# EAGLE board A10S-OLinuXino-MICRO_Rev_D (EAGLE 9.6.2), part 1 of 4
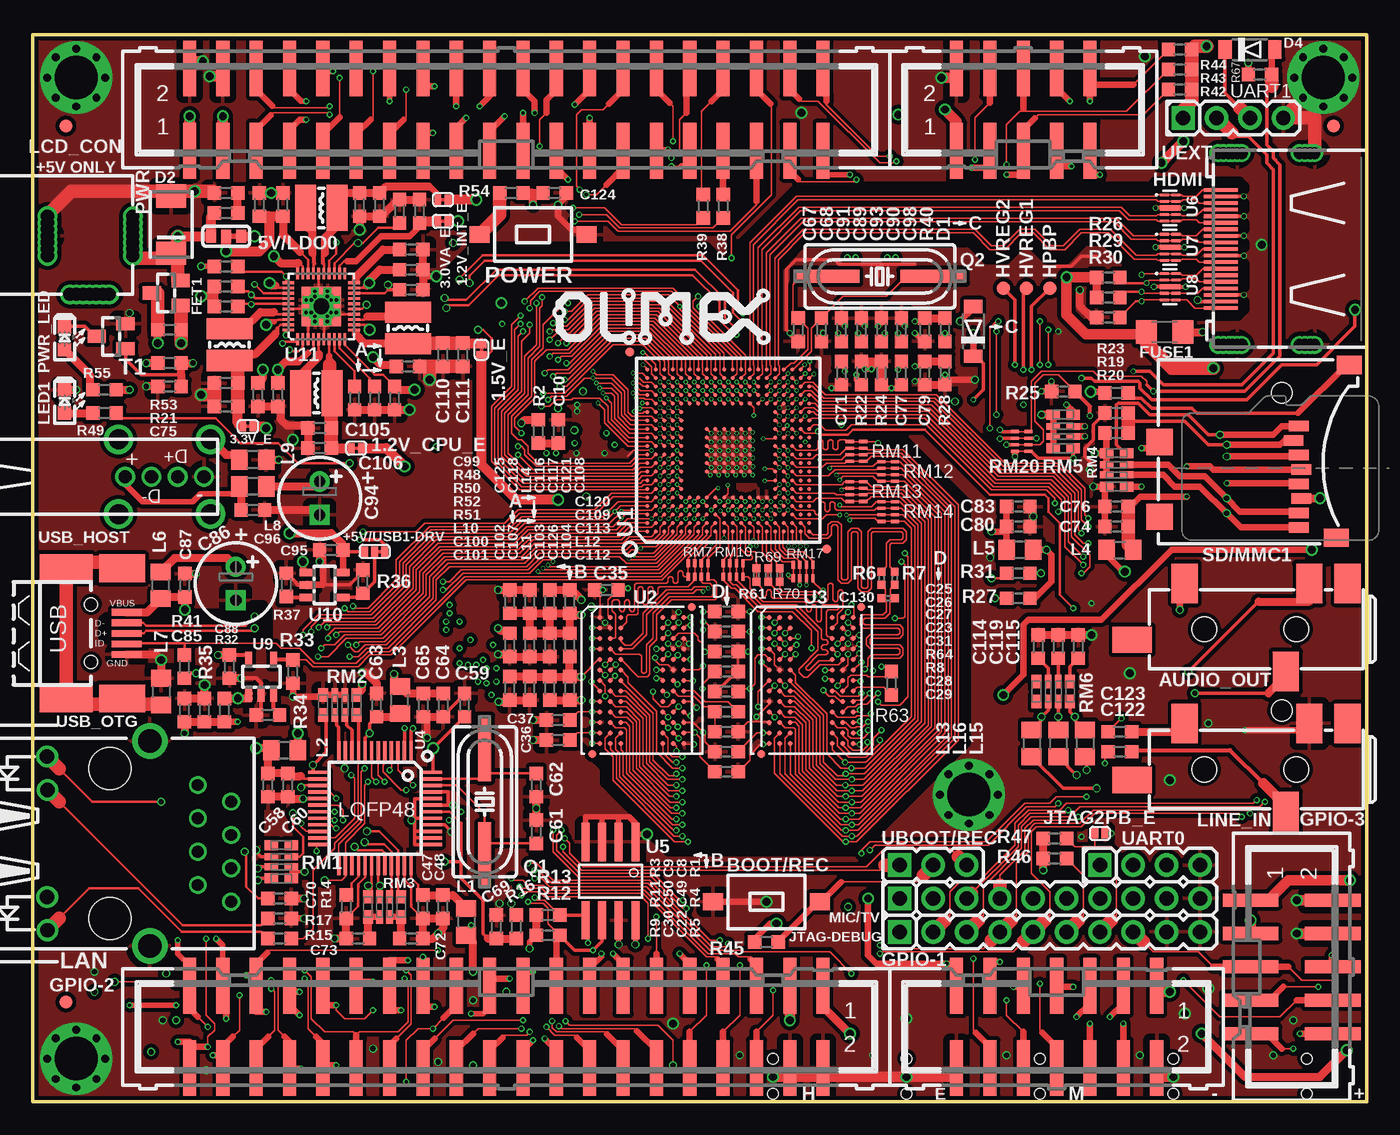
[diagram p5: board, top side]
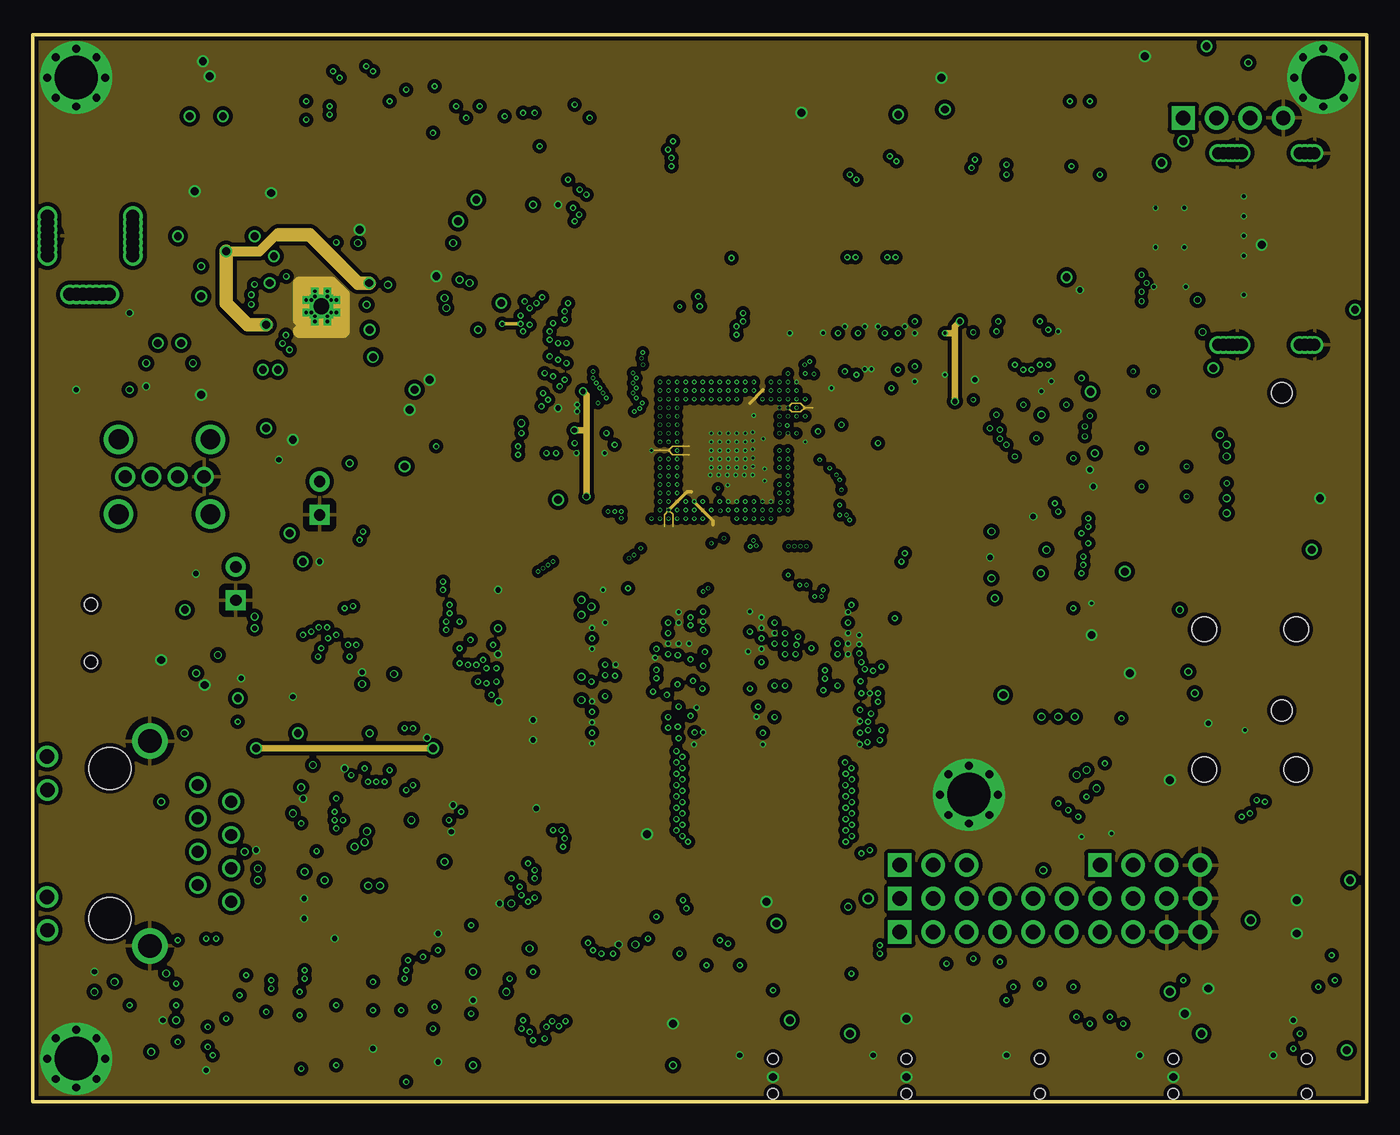
[diagram p6: board, inner layer Route2]
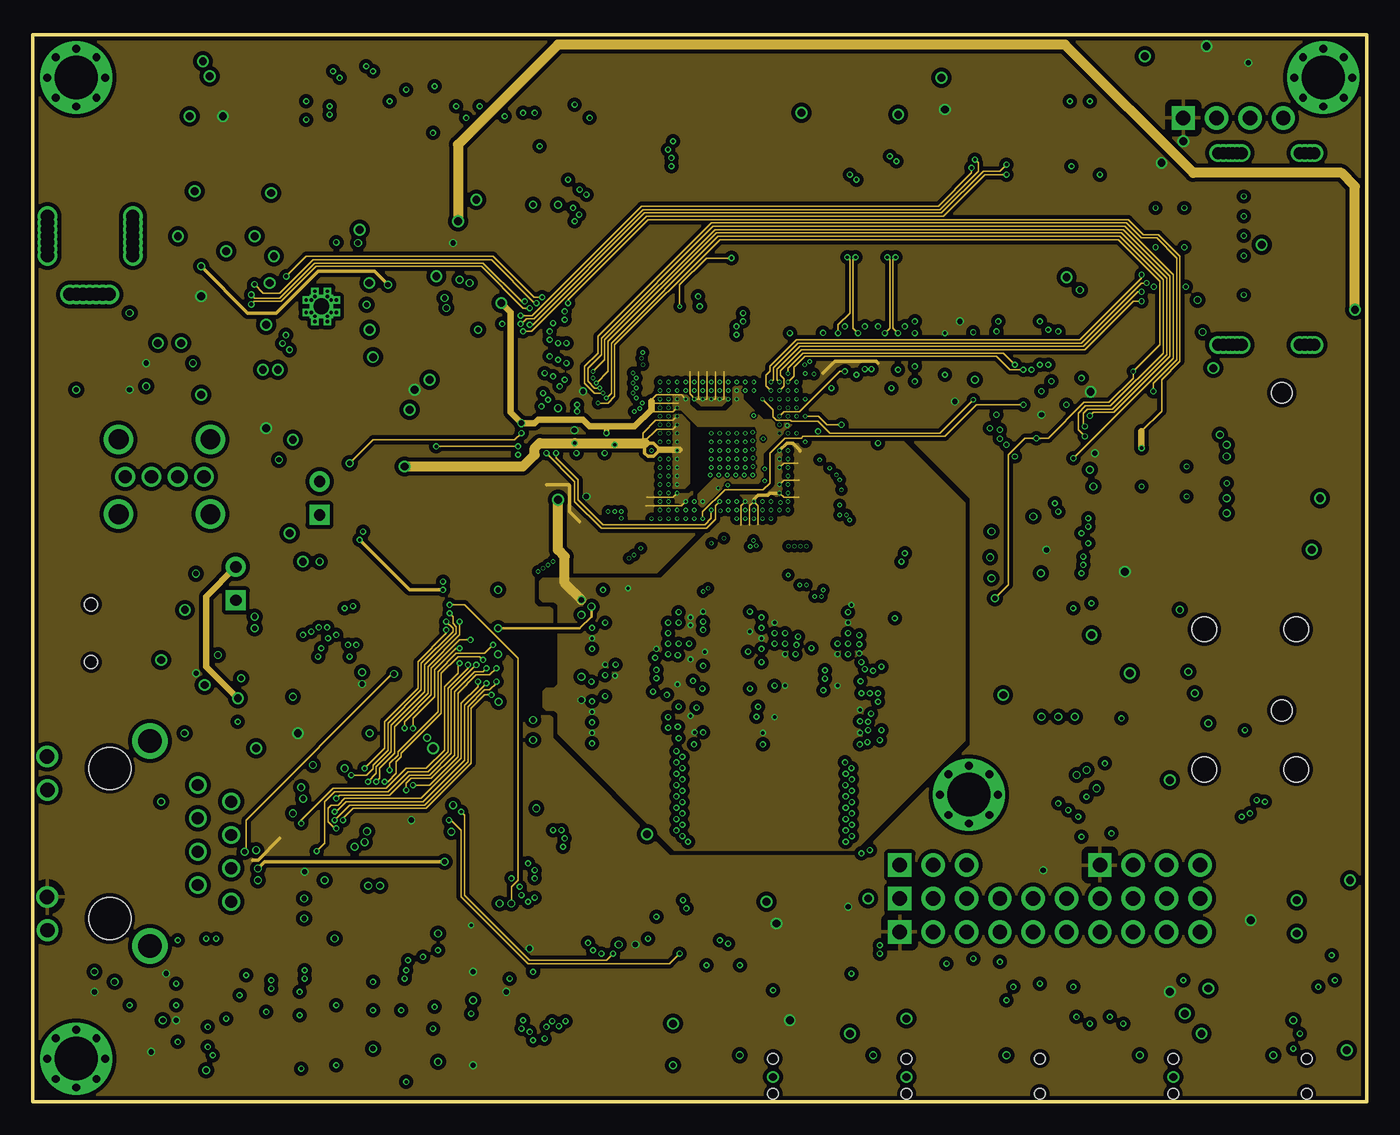
[diagram p7: board, inner layer Route15]
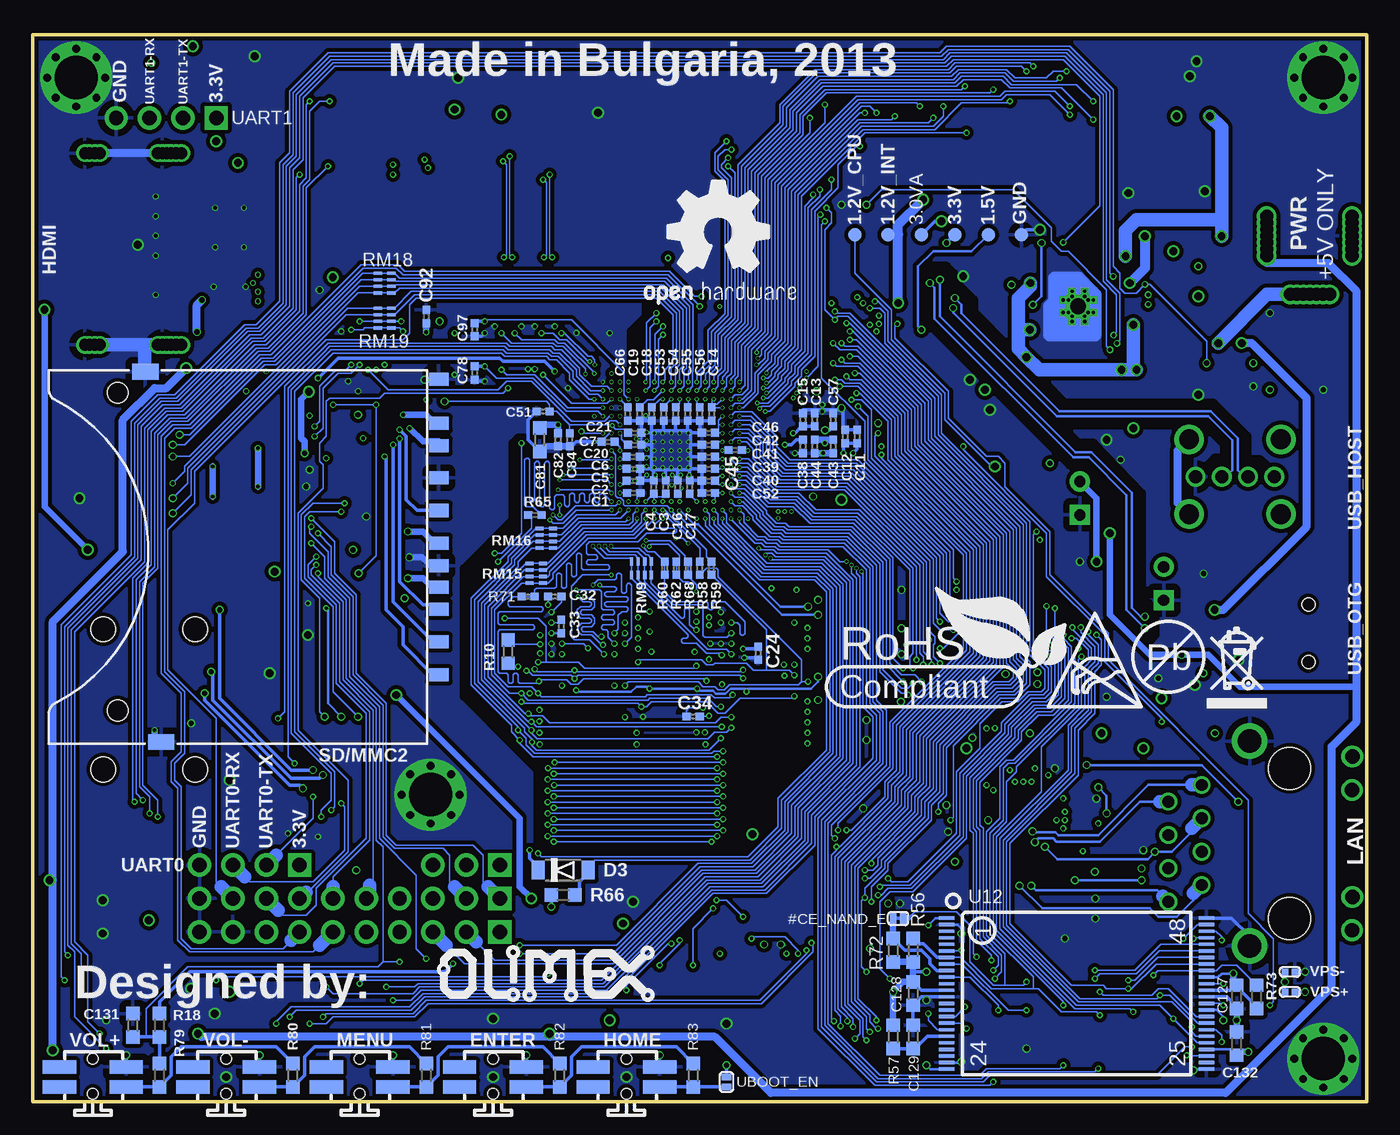
[diagram p8: board, bottom side, seen from below]

Size 101.6 x 81.28 mm. Coordinates in mm from the lower left corner, seen from the top.
Outline: 0,0 101.6,0 101.6,81.28 0,81.28 0,0
Copper layers (1*2*15*16): Top 0.018mm / dielectric 0.12mm / Route2 0.035mm / dielectric 1.2mm / Route15 0.035mm / dielectric 0.12mm / Bottom 0.018mm
Design rules "default": minimum track width 4mil, minimum drill 0.2mm, track to track 5mil, track to pad 5mil, pad to pad 5mil, via to via 5mil, smd to smd 1mil, copper to edge 10mil, drill to drill 8mil, minimum pad ring 6mil, minimum via ring 2.5mil, stop-mask expansion 4mil, vias tented up to drill 25mil, thermal gap 20mil
tRestrict: 172 lines
bRestrict: 174 lines

## Footprints (pad centres in the part's own frame; a part is rotated, then mirrored left to right if it is on the bottom)
TESTPAD_40-ROUND = smd 1.016 x 1.016: 1 0,0
SJ_1_SMALLER_CLOSE = smd 0.508 x 0.762: 1 -0.381,0; 2 0.381,0
SJ_2_SMALL_12_TIED = smd 0.762 x 1.016: 1 -1.143,0; 2 0,0; 3 1.143,0
SJ_2_SMALLER = smd 0.508 x 0.762: 1 -0.762,0; 2 0,0; 3 0.762,0
PJ-W47S-05D2-LF_5PIN_V2 = smd 2 x 3: 1 2.1,-0.5; 2 14.5,-0.5; 3 6.8,6.2; 5 5,-0.5 | smd 3 x 2: 4 18.5,3.8 | hole 1.9: 6,3; 13,3
SW-TAKT_6X3.5_SMD = smd 1.27 x 1.524: P$1 0,4.064; P$2 0,-4.064
C0402_TI = smd 0.61 x 0.584: 1 -0.508,0; 2 0.508,0
C0603_DWS = smd 1.016 x 1.016: 1 -0.889,0; 2 0.889,0
E2,5-6,3 = drill 0.864 pad 1.524: + -1.27,0 | drill 0.864 pad 1.524 square: - 1.27,0
SOD-123 = smd 1 x 1.4: A 1.9,0; C -1.9,0
DO214AA = smd 1.778 x 2.286: A 2.177,0; C -2.177,0
SW_TAKT3X4 = smd 2.54 x 1.016: 1_1 -2.54,0.762; 1_2 2.54,0.762; 2_1 -2.54,-0.762; 2_2 2.54,-0.762 | hole 0.8: 0,-1.397; 0,1.27
SOT23 = smd 1 x 1.4: 1 -0.95,-1.1; 2 0.95,-1.1; 3 0,1.1
1206 = smd 1.6 x 1.8: 1 -1.4,0; 2 1.4,0
ML14_S = smd 1 x 4.25: 1 -7.62,-3.125; 2 -7.62,3.125; 3 -5.08,-3.125; 4 -5.08,3.125; 5 -2.54,-3.125; 6 -2.54,3.125; 7 0,-3.125; 8 0,3.125; 9 2.54,-3.125; 10 2.54,3.125; 11 5.08,-3.125; 12 5.08,3.125; 13 7.62,-3.125; 14 7.62,3.125
ML40-MALE(GBH-254-SMT-40) = smd 1 x 4.25: 1 -24.13,-3.125; 2 -24.13,3.125; 3 -21.59,-3.125; 4 -21.59,3.125; 5 -19.05,-3.125; 6 -19.05,3.125; 7 -16.51,-3.125; 8 -16.51,3.125; 9 -13.97,-3.125; 10 -13.97,3.125; 11 -11.43,-3.125; 12 -11.43,3.125; 13 -8.89,-3.125; 14 -8.89,3.125; 15 -6.35,-3.125; 16 -6.35,3.125; 17 -3.81,-3.125; 18 -3.81,3.125; 19 -1.27,-3.125; 20 -1.27,3.125; 21 1.27,-3.125; 22 1.27,3.125; 23 3.81,-3.125; 24 3.81,3.125; 25 6.35,-3.125; 26 6.35,3.125; 27 8.89,-3.125; 28 8.89,3.125; 29 11.43,-3.125; 30 11.43,3.125; 31 13.97,-3.125; 32 13.97,3.125; 33 16.51,-3.125; 34 16.51,3.125; 35 19.05,-3.125; 36 19.05,3.125; 37 21.59,-3.125; 38 21.59,3.125; 39 24.13,-3.125; 40 24.13,3.125
ML10_S = smd 1 x 4.25: 1 -5.08,-3.125; 2 -5.08,3.125; 3 -2.54,-3.125; 4 -2.54,3.125; 5 0,-3.125; 6 0,3.125; 7 2.54,-3.125; 8 2.54,3.125; 9 5.08,-3.125; 10 5.08,3.125
HDMI-SWM-19 = smd 2.6 x 0.28: 1 1.3,4.5; 2 1.3,4; 3 1.3,3.5; 4 1.3,3; 5 1.3,2.5; 6 1.3,2; 7 1.3,1.5; 8 1.3,1; 9 1.3,0.5; 10 1.3,0; 11 1.3,-0.5; 12 1.3,-1; 13 1.3,-1.5; 14 1.3,-2; 15 1.3,-2.5; 16 1.3,-3; 17 1.3,-3.5; 18 1.3,-4; 19 1.3,-4.5 | drill 0.9: P$5 1.5,7.3; P$7 7.7,7.3; P$9 7.7,-7.3; P$11 1.5,-7.3; P$13 1.9,7.3; P$15 8.1,7.3; P$18 8.1,-7.3; P$20 1.9,-7.3; P$21 2.2,7.3; P$22 2.9,7.3; P$23 2.9,-7.3; P$24 2.2,-7.3; P$25 1.1,7.3; P$26 1.1,-7.3; P$27 7.3,-7.3; P$28 7.3,7.3; SH1 2.55,7.3; SH2 8.45,7.3; SH3 8.45,-7.3; SH4 2.55,-7.3
SJ_1_SMALLER = smd 0.508 x 0.762: 1 -0.381,0; 2 0.381,0
HN1X10 = drill 1.1 pad 1.778 square: 1 -11.43,0 | drill 1.1 pad 1.778: 2 -8.89,0; 3 -6.35,0; 4 -3.81,0; 5 -1.27,0; 6 1.27,0; 7 3.81,0; 8 6.35,0; 9 8.89,0; 10 11.43,0
L0805_5MIL_DWS = smd 1.27 x 1.524: 1 -1.016,0; 2 1.016,0
CD32 = smd 3.5 x 1.6: 1 0,1.2; 2 0,-1.2
RJLBC-060TC1 = drill 0.9: 1 -4.455,6.7; 2 -3.185,9.24; 3 -1.915,6.7; 4 -0.645,9.24; 5 0.625,6.7; 6 1.895,9.24; 7 3.165,6.7; 8 4.435,9.24 | drill 1.1: AG 4.07,-4.773; AY -6.61,-4.773; KG 6.61,-4.748; KY -4.07,-4.748 | drill 1.8: GND1 -7.8,3.05; GND2 7.8,3.05 | hole 3.2: -5.715,0; 5.715,0
LED-0603 = smd 1.016 x 1.016: A 0.889,0; C -0.889,0
PWR_JACK_UNI_MILLING = drill 1: + 0,4.75; +1 0,5.25; +2 0,5.75; +3 0,6.25; +4 0,4.25; +5 0,3.75; +6 0,3.25; - -6.5,4.75; -1 -6.5,5.25; -2 -6.5,5.75; -3 -6.5,4.25; -4 -6.5,3.75; -5 -6.5,6.25; -6 -6.5,3.25; -- -3.3,0.3; --1 -3.8,0.3; --2 -4.3,0.3; --3 -4.8,0.3; --4 -2.8,0.3; --5 -2.3,0.3; --6 -1.8,0.3
HC49/SMD2_THIN = smd 5 x 1: 1 -4.064,0; 2 4.064,0
R0603_5MIL_DWS = smd 1.016 x 1.016: 1 -0.889,0; 2 0.889,0
R0402_TI = smd 0.61 x 0.584: 1 -0.508,0; 2 0.508,0
0603_0R = smd 1.016 x 1.016: 1 -0.889,0; 2 0.889,0
R0402_TI_0R = smd 0.61 x 0.584: 1 -0.508,0; 2 0.508,0
R_MATRIX_4 = smd 1.016 x 0.762: 1.1 -0.762,1.27; 1.2 0.762,1.27; 4.1 -0.762,-1.27; 4.2 0.762,-1.27 | smd 1.016 x 0.508: 2.1 -0.762,0.381; 2.2 0.762,0.381; 3.1 -0.762,-0.381; 3.2 0.762,-0.381
R_MATRIX_4_0402_25_625_0R = smd 0.625 x 0.25: 1.1 -0.512,0.75; 1.2 0.512,0.75; 2.1 -0.512,0.25; 2.2 0.512,0.25; 3.1 -0.512,-0.25; 3.2 0.512,-0.25; 4.1 -0.512,-0.75; 4.2 0.512,-0.75
TFR-MEM-CON = smd 0.8 x 1.5: 1 -3.2,10.7; 2 -2.1,10.3; 3 -1,10.7; 4 0.1,10.9; 5 1.2,10.7; 6 2.3,10.9; 7 3.4,10.7; 8 4.5,10.7 | smd 2 x 2: 9 3.7,0.1; 10 -2,0.1 | smd 1.4 x 1.9: 11 5.3,13.55; 12 -7.85,14.55
SD_CARD = smd 1 x 1.5: 1 6.88,15.3; 2 4.38,15.3; 3 1.08,15.3; 4 -0.63,15.3; 5 -3.13,15.3; 6 -5.63,15.3; 7 -8.06,15.3; 8 -9.76,15.3; 9 9.38,15.3; CD 2.73,15.3; WP -13.11,15.3 | smd 1.2 x 2: SH1 -13.7,-7.05; SH2 14.5,-5.85 | hole 1.6: -12.09,-9.15; 12.1,-9.15
SOT-23 = smd 1 x 1.4: 1 -0.95,-1.1; 2 0.95,-1.1; 3 0,1.1
TFBGA336 = smd 0.32 x 0.32: A1 -6.175,6.175; A2 -5.525,6.175; A3 -4.875,6.175; A4 -4.225,6.175; A5 -3.575,6.175; A6 -2.925,6.175; A7 -2.275,6.175; A8 -1.625,6.175; A9 -0.975,6.175; A10 -0.325,6.175; A11 0.325,6.175; A12 0.975,6.175; A13 1.625,6.175; A14 2.275,6.175; A15 2.925,6.175; A16 3.575,6.175; A17 4.225,6.175; A18 4.875,6.175; A19 5.525,6.175; A20 6.175,6.175; B1 -6.175,5.525; B2 -5.525,5.525; B3 -4.875,5.525; B4 -4.225,5.525; B5 -3.575,5.525; B6 -2.925,5.525; B7 -2.275,5.525; B8 -1.625,5.525; B9 -0.975,5.525; B10 -0.325,5.525; B11 0.325,5.525; B12 0.975,5.525; B13 1.625,5.525; B14 2.275,5.525; B15 2.925,5.525; B16 3.575,5.525; B17 4.225,5.525; B18 4.875,5.525; B19 5.525,5.525; B20 6.175,5.525; C1 -6.175,4.875; C2 -5.525,4.875; C3 -4.875,4.875; C4 -4.225,4.875; C5 -3.575,4.875; C6 -2.925,4.875; C7 -2.275,4.875; C8 -1.625,4.875; C9 -0.975,4.875; C10 -0.325,4.875; C11 0.325,4.875; C12 0.975,4.875; C13 1.625,4.875; C14 2.275,4.875; C15 2.925,4.875; C16 3.575,4.875; C17 4.225,4.875; C18 4.875,4.875; C19 5.525,4.875; C20 6.175,4.875; D1 -6.175,4.225; D2 -5.525,4.225; D3 -4.875,4.225; D4 -4.225,4.225; D5 -3.575,4.225; D6 -2.925,4.225; D7 -2.275,4.225; D8 -1.625,4.225; D9 -0.975,4.225; D10 -0.325,4.225; D11 0.325,4.225; D12 0.975,4.225; D13 1.625,4.225; D14 2.275,4.225; D15 2.925,4.225; D16 3.575,4.225; D17 4.225,4.225; D18 4.875,4.225; D19 5.525,4.225; D20 6.175,4.225; E1 -6.175,3.575; E2 -5.525,3.575; E3 -4.875,3.575; E4 -4.225,3.575; E5 -3.575,3.575; E6 -2.925,3.575; E7 -2.275,3.575; E8 -1.625,3.575; E9 -0.975,3.575; E10 -0.325,3.575; E11 0.325,3.575; E12 0.975,3.575; E13 1.625,3.575; E14 2.275,3.575; E15 2.925,3.575; E16 3.575,3.575; E17 4.225,3.575; E18 4.875,3.575; E19 5.525,3.575; E20 6.175,3.575; F1 -6.175,2.925; F2 -5.525,2.925; F3 -4.875,2.925; F4 -4.225,2.925; F5 -3.575,2.925; F16 3.575,2.925; F17 4.225,2.925; F18 4.875,2.925; F19 5.525,2.925; F20 6.175,2.925; G1 -6.175,2.275; G2 -5.525,2.275; G3 -4.875,2.275; G4 -4.225,2.275; G5 -3.575,2.275; G16 3.575,2.275; G17 4.225,2.275; G18 4.875,2.275; G19 5.525,2.275; G20 6.175,2.275; H1 -6.175,1.625; H2 -5.525,1.625; H3 -4.875,1.625; H4 -4.225,1.625; H5 -3.575,1.625; H8 -1.625,1.625; H9 -0.975,1.625; H10 -0.325,1.625; H11 0.325,1.625; H12 0.975,1.625; H13 1.625,1.625; H16 3.575,1.625; H17 4.225,1.625; H18 4.875,1.625; H19 5.525,1.625; H20 6.175,1.625; J1 -6.175,0.975; J2 -5.525,0.975; J3 -4.875,0.975; J4 -4.225,0.975; J5 -3.575,0.975; J8 -1.625,0.975; J9 -0.975,0.975; J10 -0.325,0.975; J11 0.325,0.975; J12 0.975,0.975; J13 1.625,0.975; J16 3.575,0.975; J17 4.225,0.975; J18 4.875,0.975; J19 5.525,0.975; J20 6.175,0.975; K1 -6.175,0.325; K2 -5.525,0.325; K3 -4.875,0.325; K4 -4.225,0.325; K5 -3.575,0.325; K8 -1.625,0.325; K9 -0.975,0.325; K10 -0.325,0.325; K11 0.325,0.325; K12 0.975,0.325; K13 1.625,0.325; K16 3.575,0.325; K17 4.225,0.325; K18 4.875,0.325; K19 5.525,0.325; K20 6.175,0.325; L1 -6.175,-0.325; L2 -5.525,-0.325; L3 -4.875,-0.325; L4 -4.225,-0.325; L5 -3.575,-0.325; L8 -1.625,-0.325; L9 -0.975,-0.325; L10 -0.325,-0.325; L11 0.325,-0.325; L12 0.975,-0.325; L13 1.625,-0.325; L16 3.575,-0.325; L17 4.225,-0.325; L18 4.875,-0.325; L19 5.525,-0.325; L20 6.175,-0.325; M1 -6.175,-0.975; M2 -5.525,-0.975; M3 -4.875,-0.975; M4 -4.225,-0.975; M5 -3.575,-0.975; M8 -1.625,-0.975; M9 -0.975,-0.975; M10 -0.325,-0.975; M11 0.325,-0.975; M12 0.975,-0.975; M13 1.625,-0.975; M16 3.575,-0.975; M17 4.225,-0.975; M18 4.875,-0.975; M19 5.525,-0.975; M20 6.175,-0.975; N1 -6.175,-1.625; N2 -5.525,-1.625; N3 -4.875,-1.625; N4 -4.225,-1.625; N5 -3.575,-1.625; N8 -1.625,-1.625; N9 -0.975,-1.625; N10 -0.325,-1.625; N11 0.325,-1.625; N12 0.975,-1.625; N13 1.625,-1.625; N16 3.575,-1.625; N17 4.225,-1.625; N18 4.875,-1.625; N19 5.525,-1.625; N20 6.175,-1.625; P1 -6.175,-2.275; P2 -5.525,-2.275; P3 -4.875,-2.275; P4 -4.225,-2.275; P5 -3.575,-2.275; P16 3.575,-2.275; P17 4.225,-2.275; P18 4.875,-2.275; P19 5.525,-2.275; P20 6.175,-2.275; R1 -6.175,-2.925; R2 -5.525,-2.925; R3 -4.875,-2.925; R4 -4.225,-2.925; R5 -3.575,-2.925; R16 3.575,-2.925; R17 4.225,-2.925; R18 4.875,-2.925; R19 5.525,-2.925; R20 6.175,-2.925; T1 -6.175,-3.575; T2 -5.525,-3.575; T3 -4.875,-3.575; T4 -4.225,-3.575; T5 -3.575,-3.575; T6 -2.925,-3.575; T7 -2.275,-3.575; T8 -1.625,-3.575; T9 -0.975,-3.575; T10 -0.325,-3.575; T11 0.325,-3.575; T12 0.975,-3.575; T13 1.625,-3.575; T14 2.275,-3.575; T15 2.925,-3.575; T16 3.575,-3.575; T17 4.225,-3.575; T18 4.875,-3.575; T19 5.525,-3.575; T20 6.175,-3.575; U1 -6.175,-4.225; U2 -5.525,-4.225; U3 -4.875,-4.225; U4 -4.225,-4.225; U5 -3.575,-4.225; U6 -2.925,-4.225; U7 -2.275,-4.225; U8 -1.625,-4.225; U9 -0.975,-4.225; U10 -0.325,-4.225; U11 0.325,-4.225; U12 0.975,-4.225; U13 1.625,-4.225; U14 2.275,-4.225; U15 2.925,-4.225; U16 3.575,-4.225; U17 4.225,-4.225; U18 4.875,-4.225; U19 5.525,-4.225; U20 6.175,-4.225; V1 -6.175,-4.875; V2 -5.525,-4.875; V3 -4.875,-4.875; V4 -4.225,-4.875; V5 -3.575,-4.875; V6 -2.925,-4.875; V7 -2.275,-4.875; V8 -1.625,-4.875; V9 -0.975,-4.875; V10 -0.325,-4.875; V11 0.325,-4.875; V12 0.975,-4.875; V13 1.625,-4.875; V14 2.275,-4.875; V15 2.925,-4.875; V16 3.575,-4.875; V17 4.225,-4.875; V18 4.875,-4.875; V19 5.525,-4.875; V20 6.175,-4.875; W1 -6.175,-5.525; W2 -5.525,-5.525; W3 -4.875,-5.525; W4 -4.225,-5.525; W5 -3.575,-5.525; W6 -2.925,-5.525; W7 -2.275,-5.525; W8 -1.625,-5.525; W9 -0.975,-5.525; W10 -0.325,-5.525; W11 0.325,-5.525; W12 0.975,-5.525; W13 1.625,-5.525; W14 2.275,-5.525; W15 2.925,-5.525; W16 3.575,-5.525; W17 4.225,-5.525; W18 4.875,-5.525; W19 5.525,-5.525; W20 6.175,-5.525; Y1 -6.175,-6.175; Y2 -5.525,-6.175; Y3 -4.875,-6.175; Y4 -4.225,-6.175; Y5 -3.575,-6.175; Y6 -2.925,-6.175; Y7 -2.275,-6.175; Y8 -1.625,-6.175; Y9 -0.975,-6.175; Y10 -0.325,-6.175; Y11 0.325,-6.175; Y12 0.975,-6.175; Y13 1.625,-6.175; Y14 2.275,-6.175; Y15 2.925,-6.175; Y16 3.575,-6.175; Y17 4.225,-6.175; Y18 4.875,-6.175; Y19 5.525,-6.175; Y20 6.175,-6.175 | smd 0.7 x 0.7: FID1 -7.5,-7.5; FID2 7.5,7.5
FBGA78 = smd 0.4 x 0.4: A1 -3.2,4.8; A2 -2.4,4.8; A3 -1.6,4.8; A7 1.6,4.8; A8 2.4,4.8; A9 3.2,4.8; B1 -3.2,4; B2 -2.4,4; B3 -1.6,4; B7 1.6,4; B8 2.4,4; B9 3.2,4; C1 -3.2,3.2; C2 -2.4,3.2; C3 -1.6,3.2; C7 1.6,3.2; C8 2.4,3.2; C9 3.2,3.2; D1 -3.2,2.4; D2 -2.4,2.4; D3 -1.6,2.4; D7 1.6,2.4; D8 2.4,2.4; D9 3.2,2.4; E1 -3.2,1.6; E2 -2.4,1.6; E3 -1.6,1.6; E7 1.6,1.6; E8 2.4,1.6; E9 3.2,1.6; F1 -3.2,0.8; F2 -2.4,0.8; F3 -1.6,0.8; F7 1.6,0.8; F8 2.4,0.8; F9 3.2,0.8; G1 -3.2,0; G2 -2.4,0; G3 -1.6,0; G7 1.6,0; G8 2.4,0; G9 3.2,0; H1 -3.2,-0.8; H2 -2.4,-0.8; H3 -1.6,-0.8; H7 1.6,-0.8; H8 2.4,-0.8; H9 3.2,-0.8; J1 -3.2,-1.6; J2 -2.4,-1.6; J3 -1.6,-1.6; J7 1.6,-1.6; J8 2.4,-1.6; J9 3.2,-1.6; K1 -3.2,-2.4; K2 -2.4,-2.4; K3 -1.6,-2.4; K7 1.6,-2.4; K8 2.4,-2.4; K9 3.2,-2.4; L1 -3.2,-3.2; L2 -2.4,-3.2; L3 -1.6,-3.2; L7 1.6,-3.2; L8 2.4,-3.2; L9 3.2,-3.2; M1 -3.2,-4; M2 -2.4,-4; M3 -1.6,-4; M7 1.6,-4; M8 2.4,-4; M9 3.2,-4; N1 -3.2,-4.8; N2 -2.4,-4.8; N3 -1.6,-4.8; N7 1.6,-4.8; N8 2.4,-4.8; N9 3.2,-4.8 | smd 0.6 x 0.6: FID1 -3.8,-5.6; FID2 3.8,5.6
LQFP48 = smd 0.254 x 1.6: 1 -2.75,-4.3; 2 -2.25,-4.3; 3 -1.75,-4.3; 4 -1.25,-4.3; 5 -0.75,-4.3; 6 -0.25,-4.3; 7 0.25,-4.3; 8 0.75,-4.3; 9 1.25,-4.3; 10 1.75,-4.3; 11 2.25,-4.3; 12 2.75,-4.3; 25 2.75,4.3; 26 2.25,4.3; 27 1.75,4.3; 28 1.25,4.3; 29 0.75,4.3; 30 0.25,4.3; 31 -0.25,4.3; 32 -0.75,4.3; 33 -1.25,4.3; 34 -1.75,4.3; 35 -2.25,4.3; 36 -2.75,4.3 | smd 1.6 x 0.254: 13 4.3,-2.75; 14 4.3,-2.25; 15 4.3,-1.75; 16 4.3,-1.25; 17 4.3,-0.75; 18 4.3,-0.25; 19 4.3,0.25; 20 4.3,0.75; 21 4.3,1.25; 22 4.3,1.75; 23 4.3,2.25; 24 4.3,2.75; 37 -4.3,2.75; 38 -4.3,2.25; 39 -4.3,1.75; 40 -4.3,1.25; 41 -4.3,0.75; 42 -4.3,0.25; 43 -4.3,-0.25; 44 -4.3,-0.75; 45 -4.3,-1.25; 46 -4.3,-1.75; 47 -4.3,-2.25; 48 -4.3,-2.75
SO-08MN = smd 0.61 x 2.921: 1 -1.905,-2.981; 2 -0.635,-2.981; 3 0.635,-2.981; 4 1.905,-2.981; 5 1.905,2.981; 6 0.635,2.981; 7 -0.635,2.981; 8 -1.905,2.981
SLP2510P8 = smd 0.2 x 0.675: 1 -1,-0.438; 2 -0.5,-0.438; 4 0.5,-0.438; 5 1,-0.438; 6 1,0.438; 7 0.5,0.438; 9 -0.5,0.438; 10 -1,0.438 | smd 0.4 x 0.775: 3 0,-0.388; 8 0,0.388
SOT23-5 = smd 0.55 x 1.2: 1 -0.95,-1.3; 2 0,-1.3; 3 0.95,-1.3; 4 0.95,1.3; 5 -0.95,1.3
QFN40_5X5 = smd 0.2 x 0.9: 1 -1.8,-2.5; 2 -1.4,-2.5; 3 -1,-2.5; 4 -0.6,-2.5; 5 -0.2,-2.5; 6 0.2,-2.5; 7 0.6,-2.5; 8 1,-2.5; 9 1.4,-2.5; 10 1.8,-2.5; 21 1.8,2.5; 22 1.4,2.5; 23 1,2.5; 24 0.6,2.5; 25 0.2,2.5; 26 -0.2,2.5; 27 -0.6,2.5; 28 -1,2.5; 29 -1.4,2.5; 30 -1.8,2.5 | smd 0.9 x 0.2: 11 2.5,-1.8; 12 2.5,-1.4; 13 2.5,-1; 14 2.5,-0.6; 15 2.5,-0.2; 16 2.5,0.2; 17 2.5,0.6; 18 2.5,1; 19 2.5,1.4; 20 2.5,1.8; 31 -2.5,1.8; 32 -2.5,1.4; 33 -2.5,1; 34 -2.5,0.6; 35 -2.5,0.2; 36 -2.5,-0.2; 37 -2.5,-0.6; 38 -2.5,-1; 39 -2.5,-1.4; 40 -2.5,-1.8 | drill 1.2 pad 1.422 square: N1 0,0 | drill 0.254 pad 0.4 square: N2 -1.15,0.475; N3 -0.75,0.475; N4 -1.15,-0.475; N5 -0.75,-0.475; N6 -0.475,-1.15; N7 -0.475,-0.75; N8 0.475,-1.15; N9 0.475,-0.75; N10 1.15,-0.475; N11 0.75,-0.475; N12 1.15,0.475; N13 0.75,0.475; N14 0.475,1.15; N15 0.475,0.75; N16 -0.475,1.15; N17 -0.475,0.75 | smd 3 x 3: VSS 0,0
TSOP48 = smd 0.25 x 1.2: 1 -5.75,-9.9; 2 -5.25,-9.9; 3 -4.75,-9.9; 4 -4.25,-9.9; 5 -3.75,-9.9; 6 -3.25,-9.9; 7 -2.75,-9.9; 8 -2.25,-9.9; 9 -1.75,-9.9; 10 -1.25,-9.9; 11 -0.75,-9.9; 12 -0.25,-9.9; 13 0.25,-9.9; 14 0.75,-9.9; 15 1.25,-9.9; 16 1.75,-9.9; 17 2.25,-9.9; 18 2.75,-9.9; 19 3.25,-9.9; 20 3.75,-9.9; 21 4.25,-9.9; 22 4.75,-9.9; 23 5.25,-9.9; 24 5.75,-9.9; 25 5.75,9.9; 26 5.25,9.9; 27 4.75,9.9; 28 4.25,9.9; 29 3.75,9.9; 30 3.25,9.9; 31 2.75,9.9; 32 2.25,9.9; 33 1.75,9.9; 34 1.25,9.9; 35 0.75,9.9; 36 0.25,9.9; 37 -0.25,9.9; 38 -0.75,9.9; 39 -1.25,9.9; 40 -1.75,9.9; 41 -2.25,9.9; 42 -2.75,9.9; 43 -3.25,9.9; 44 -3.75,9.9; 45 -4.25,9.9; 46 -4.75,9.9; 47 -5.25,9.9; 48 -5.75,9.9
FIDUCIAL-1X2 = smd 1 x 1: 1 0,0
HN1X4 = drill 1.1 pad 1.778 square: 1 -3.81,0 | drill 1.1 pad 1.778: 2 -1.27,0; 3 1.27,0; 4 3.81,0
JP2 = drill 1.1 pad 1.778 square: 1 -2.54,0 | drill 1.1 pad 1.778: 2 0,0; 3 2.54,0
USB_A_VERTICAL_PTH = drill 1: 1 3.45,12.75; 2 3.45,14.75; 3 3.45,16.75; 4 3.45,18.75 | drill 1.5: P$1 0.6,12.25; P$2 6.3,12.25; P$3 6.3,19.25; P$4 0.6,19.25
USB_MINI_9PIN = smd 2.25 x 0.5: D+ 2.706,0; D- 2.706,0.8; GND 2.706,-1.6; ID 2.706,-0.8; VBUS 2.706,1.6 | smd 4 x 2.1: GND1 -1.9,4.95; GND3 -1.9,-4.95 | smd 3.5 x 2.1: GND2 2.35,4.95; GND4 2.35,-4.95 | hole 1: 0,2.2; 0,-2.2
SJ_1_THE_SMALLEST = smd 0.508 x 0.508: 1 -0.381,0; 2 0.381,0

## Placement (x,y rotation side)
1.2V_CPU  TESTPADTESTPAD_40-ROUND  [TESTPAD_40-ROUND]  38.99,66.04 270 bottom
1.2V_CPU_E  Close  [SJ_1_SMALLER_CLOSE]  24.64,49.78 0 top
1.2V_INT  TESTPADTESTPAD_40-ROUND  [TESTPAD_40-ROUND]  36.45,66.04 270 bottom
1.2V_INT_E  Close  [SJ_1_SMALLER_CLOSE]  31.24,68.71 0 top
1.5V  TESTPADTESTPAD_40-ROUND  [TESTPAD_40-ROUND]  28.83,66.04 270 bottom
1.5V_E  Close  [SJ_1_SMALLER_CLOSE]  34.16,57.28 270 top
3.0VA  TESTPADTESTPAD_40-ROUND  [TESTPAD_40-ROUND]  33.91,66.04 270 bottom
3.0VA_E  Close  [SJ_1_SMALLER_CLOSE]  31.24,67.06 0 top
3.3V  TESTPADTESTPAD_40-ROUND  [TESTPAD_40-ROUND]  31.37,66.04 270 bottom
3.3V_E  Close  [SJ_1_SMALLER_CLOSE]  16.38,51.44 0 top
5V/LDO0  5V:Open/LDO0:Close  [SJ_2_SMALL_12_TIED]  14.73,65.91 180 top
#CE_NAND_E  Close  [SJ_1_SMALLER_CLOSE]  35.69,13.97 0 bottom
+5V/USB1-DRV  [SJ_2_SMALLER]  26.04,41.91 180 top
AUDIO_OUT  PJ-W47S-05D2-LF_V2  [PJ-W47S-05D2-LF_5PIN_V2]  102.23,38.99 180 top
BOOT/REC  T1107A(6x3.8x2.5mm)  [SW-TAKT_6X3.5_SMD]  55.88,15.24 90 top
C1  220nF  [C0402_TI]  55.83,46.38 180 bottom
C2  220nF  [C0402_TI]  55.85,47.29 180 bottom
C3  220nF  [C0402_TI]  53.39,46.84 270 bottom
C4  220nF  [C0402_TI]  54.31,46.84 270 bottom
C5  220nF  [C0402_TI]  55.85,48.21 180 bottom
C6  220nF  [C0402_TI]  55.85,49.12 180 bottom
C7  220nF  [C0402_TI]  57.78,50.27 0 bottom
C8  220nF  [C0603_DWS]  39.37,38.1 270 top
C9  220nF  [C0603_DWS]  37.85,38.1 270 top
C10  22uF/6.3V  [C0603_DWS]  40.03,51.05 270 top
C11  220nF  [C0402_TI]  38.81,50.67 270 bottom
C12  220nF  [C0402_TI]  39.73,50.67 270 bottom
C13  220nF  [C0402_TI]  42.04,51.94 270 bottom
C14  220nF  [C0402_TI]  49.89,52.37 90 bottom
C15  220nF  [C0402_TI]  42.94,51.94 270 bottom
C16  220nF  [C0402_TI]  52.48,46.84 270 bottom
C17  220nF  [C0402_TI]  51.56,46.84 270 bottom
C18  220nF  [C0402_TI]  54.46,52.37 90 bottom
C19  220nF  [C0402_TI]  55.37,52.37 90 bottom
C20  220nF  [C0402_TI]  55.75,50.04 180 bottom
C21  220nF  [C0402_TI]  55.75,50.95 180 bottom
C22  220nF  [C0603_DWS]  39.37,31.5 90 top
C23  220nF  [C0603_DWS]  52.83,32.77 180 top
C24  220nF  [C0402_TI]  46.35,34.16 90 bottom
C25  220nF  [C0603_DWS]  52.83,37.34 180 top
C26  220nF  [C0603_DWS]  52.83,35.81 0 top
C27  220nF  [C0603_DWS]  52.83,34.29 180 top
C28  220nF  [C0603_DWS]  52.83,26.67 0 top
C29  220nF  [C0603_DWS]  52.83,25.15 180 top
C30  220nF  [C0603_DWS]  37.85,31.5 90 top
C31  220nF  [C0603_DWS]  52.83,31.24 0 top
C32  220nF  [C0402_TI]  61.85,38.48 180 bottom
C33  220nF  [C0402_TI]  61.34,36.2 90 bottom
C34  220nF  [C0402_TI]  51.31,29.36 0 bottom
C35  220nF  [C0603_DWS]  43.69,38.99 0 top
C36  220nF  [C0603_DWS]  40.01,27.56 0 top
C37  220nF  [C0603_DWS]  40.01,29.08 0 top
C38  220nF  [C0402_TI]  42.94,49.91 90 bottom
C39  220nF  [C0402_TI]  50.14,48.21 0 bottom
C40  220nF  [C0402_TI]  50.14,47.29 0 bottom
C41  220nF  [C0402_TI]  50.14,49.12 0 bottom
C42  220nF  [C0402_TI]  50.14,50.04 0 bottom
C43  220nF  [C0402_TI]  40.64,49.91 90 bottom
C44  220nF  [C0402_TI]  42.04,49.91 90 bottom
C45  220nF  [C0402_TI]  48.11,49.63 180 bottom
C46  220nF  [C0402_TI]  50.14,50.95 0 bottom
C47  100nF  [C0603_DWS]  29.72,14.86 90 top
C48  22uF/6.3V  [C0603_DWS]  31.24,14.86 90 top
C49  100nF  [C0603_DWS]  39.37,34.8 90 top
C50  100nF  [C0603_DWS]  37.85,34.8 90 top
C51  220nF  [C0402_TI]  62.74,52.58 0 bottom
C52  220nF  [C0402_TI]  50.14,46.38 0 bottom
C53  220nF  [C0402_TI]  53.54,52.37 90 bottom
C54  220nF  [C0402_TI]  52.63,52.37 90 bottom
C55  220nF  [C0402_TI]  51.71,52.37 90 bottom
C56  220nF  [C0402_TI]  50.8,52.37 90 bottom
C57  220nF  [C0402_TI]  40.64,51.94 270 bottom
C58  100nF  [C0603_DWS]  17.91,24.13 90 top
C59  100nF  [C0603_DWS]  32.89,30.23 270 top
C60  22uF/6.3V  [C0603_DWS]  19.43,24.13 90 top
C61  33pF  [C0603_DWS]  38.35,20.57 270 top
C62  33pF  [C0603_DWS]  38.35,24.13 90 top
C63  100nF  [C0603_DWS]  26.19,30.23 90 top
C64  100nF  [C0603_DWS]  31.27,30.23 270 top
C65  22uF/6.3V  [C0603_DWS]  29.74,30.23 270 top
C66  NA  [C0402_TI]  56.29,52.37 90 bottom
C67  33pF  [C0603_DWS]  58.29,58.8 90 top
C68  33pF  [C0603_DWS]  60.07,58.8 90 top
C69  100nF  [C0603_DWS]  35.31,13.34 270 top
C70  100nF  [C0603_DWS]  18.8,15.49 180 top
C71  22uF/6.3V  [C0603_DWS]  61.59,55.5 90 top
C72  100nF  [C0603_DWS]  28.83,12.45 180 top
C73  100nF  [C0603_DWS]  24.77,12.45 0 top
C74  22uF/6.3V  [C0603_DWS]  82.55,43.81 0 top
C75  NA  [C0603_DWS]  10.41,54.48 0 top
C76  22uF/6.3V  [C0603_DWS]  82.55,45.34 0 top
C77  1uF  [C0603_DWS]  66.17,55.5 90 top
C78  220nF  [C0402_TI]  67.94,55.5 90 bottom
C79  10uF/6.3V  [C0603_DWS]  67.94,55.5 90 top
C80  22uF/6.3V  [C0603_DWS]  75.06,43.81 180 top
C81  10uF/6.3V  [C0603_DWS]  62.99,50.42 90 bottom
C82  220nF  [C0402_TI]  61.59,50.42 90 bottom
C83  22uF/6.3V  [C0603_DWS]  75.06,45.34 180 top
C84  220nF  [C0402_TI]  60.71,50.42 90 bottom
C85  100nF  [C0603_DWS]  11.56,29.84 90 top
C86  100uF/16V/LOWESR/105C/6.3x11mm_RM2.5  [E2,5-6,3]  15.47,39.47 270 top
C87  100nF  [C0603_DWS]  11.58,39.34 90 top
C88  100nF  [C0603_DWS]  14.99,33.15 270 top
C89  1nF  [C0603_DWS]  63.12,58.8 270 top
C90  1nF  [C0603_DWS]  66.17,58.8 270 top
C91  1nF  [C0603_DWS]  61.59,58.8 270 top
C92  220nF  [C0402_TI]  71.63,59.82 270 bottom
C93  1nF  [C0603_DWS]  64.64,58.8 270 top
C94  100uF/16V/LOWESR/105C/6.3x11mm_RM2.5  [E2,5-6,3]  21.84,45.97 270 top
C95  10uF/6.3V  [C0603_DWS]  22.73,42.04 180 top
C96  100nF  [C0603_DWS]  16.76,45.09 0 top
C97  220nF  [C0402_TI]  67.94,58.8 270 bottom
C98  22uF/6.3V  [C0603_DWS]  67.94,58.8 90 top
C99  10uF/6.3V  [C0603_DWS]  14.73,69.22 180 top
C100  10uF/6.3V  [C0603_DWS]  14.73,54.74 180 top
C101  1nF  [C0603_DWS]  14.73,52.96 180 top
C102  10uF/6.3V  [C0603_DWS]  17.14,53.85 270 top
C103  NA(10uF/6.3V)  [C0603_DWS]  24.51,53.59 270 top
C104  10uF/6.3V  [C0603_DWS]  27.56,53.59 270 top
C105  10uF/6.3V  [C0603_DWS]  21.84,51.31 180 top
C106  1nF  [C0603_DWS]  21.84,49.78 180 top
C107  10uF/6.3V  [C0603_DWS]  18.67,53.85 270 top
C108  10uF/6.3V  [C0603_DWS]  29.46,67.82 90 top
C109  10uF/6.3V  [C0603_DWS]  28.83,63.37 0 top
C110  10uF/6.3V  [C0603_DWS]  31.24,56.9 270 top
C111  1nF  [C0603_DWS]  32.77,56.9 270 top
C112  10uF/6.3V  [C0603_DWS]  28.57,56.01 0 top
C113  1uF  [C0603_DWS]  28.83,61.85 0 top
C114  100nF  [C0603_DWS]  76.58,34.67 270 top
C115  100nF  [C0603_DWS]  79.63,34.67 270 top
C116  10uF/6.3V  [C0603_DWS]  24.89,68.33 270 top
C117  1nF  [C0603_DWS]  26.42,68.33 270 top
C118  10uF/6.3V  [C0603_DWS]  19.05,68.33 90 top
C119  100nF  [C0603_DWS]  78.11,34.67 270 top
C120  1uF  [C0603_DWS]  28.83,64.9 0 top
C121  1uF  [C0603_DWS]  27.94,67.82 90 top
C122  10uF/6.3V  [C0603_DWS]  82.8,26.67 180 top
C123  10uF/6.3V  [C0603_DWS]  82.8,28.19 180 top
C124  100pF  [C0603_DWS]  39.75,69.22 0 top
C125  10uF/6.3V  [C0603_DWS]  17.27,68.33 90 top
C126  NA(10uF/6.3V)  [C0603_DWS]  26.04,53.59 270 top
C127  100nF  [C0603_DWS]  9.91,8 90 bottom
C128  22uF/6.3V  [C0603_DWS]  34.54,8.26 90 bottom
C129  100nF  [C0603_DWS]  34.54,4.95 270 bottom
C130  NA(10pF)  [C0402_TI]  65.15,38.35 180 top
C131  1nF  [C0603_DWS]  93.98,5.84 90 bottom
C132  NA(2.2uF)  [C0603_DWS]  9.91,4.45 270 bottom
D1  1N5819S4  [SOD-123]  71.63,58.67 90 top
D2  SMBJ6.0A  [DO214AA]  10.54,66.8 90 top
D3  1N5819S4  [SOD-123]  61.21,17.65 0 bottom
D4  1N5819S4  [SOD-123]  92.71,80.14 0 top
ENTER  SIDE_WTCM-TR(3X4)  [SW_TAKT3X4]  66.55,1.91 180 bottom
FET1  IRLML6402  [SOT23]  10.16,61.59 90 top
FUSE1  FSMD035  [1206]  86.21,58.62 0 top
GND  TESTPADTESTPAD_40-ROUND  [TESTPAD_40-ROUND]  26.29,66.04 270 bottom
GPIO-1  GBH-254-SMT-14  [ML14_S]  77.98,5.71 180 top
GPIO-2  GBH-254-SMT-40  [ML40-MALE(GBH-254-SMT-40)]  36.07,5.71 180 top
GPIO-3  GBH-254-SMT-10  [ML10_S]  95.89,10.29 270 top
HDMI  HDMI-SWM-19  [HDMI-SWM-19]  89.18,64.95 0 top
HOME  SIDE_WTCM-TR(3X4)  [SW_TAKT3X4]  56.39,1.91 180 bottom
HPBP  TESTPADTESTPAD_40-ROUND  [TESTPAD_40-ROUND]  77.47,61.98 0 top
HVREG1  TESTPADTESTPAD_40-ROUND  [TESTPAD_40-ROUND]  75.69,61.98 0 top
HVREG2  TESTPADTESTPAD_40-ROUND  [TESTPAD_40-ROUND]  73.91,61.98 0 top
JTAG2PB_E  Open  [SJ_1_SMALLER]  81.28,20.45 180 top
JTAG-DEBUG  NA(HN1X10)  [HN1X10]  77.47,12.95 0 top
L1  FB0805/600R/200mA(201209-601)  [L0805_5MIL_DWS]  33.02,13.72 270 top
L2  FB0805/600R/200mA(201209-601)  [L0805_5MIL_DWS]  19.18,26.8 0 top
L3  FB0805/600R/200mA(201209-601)  [L0805_5MIL_DWS]  27.97,30.61 90 top
L4  CL470nH/0805/1.76R/250mA  [L0805_5MIL_DWS]  82.8,42.04 0 top
L5  CL470nH/0805/1.76R/250mA  [L0805_5MIL_DWS]  75.18,42.04 180 top
L6  FB0805/600R/2A  [L0805_5MIL_DWS]  9.75,39.34 90 top
L7  FB0805/600R/200mA(201209-601)  [L0805_5MIL_DWS]  9.78,31.24 270 top
L8  FB0805/600R/2A  [L0805_5MIL_DWS]  16.76,46.86 180 top
L9  FB0805/600R/2A  [L0805_5MIL_DWS]  16.76,48.9 180 top
L10  2.2uH/1.5A/DCR<0.1R/CD32  [CD32]  14.99,57.66 0 top
L11  2.2uH/1.5A/DCR<0.1R/CD32  [CD32]  21.59,53.98 90 top
L12  2.2uH/1.5A/DCR<0.1R/CD32  [CD32]  28.57,58.93 0 top
L13  22uH/0.6R/0805  [L0805_5MIL_DWS]  76.07,27.3 270 top
L14  2.2uH/1.5A/DCR<0.1R/CD32  [CD32]  21.97,68.07 90 top
L15  22uH/0.6R/0805  [L0805_5MIL_DWS]  80.14,27.3 270 top
L16  22uH/0.6R/0805  [L0805_5MIL_DWS]  78.11,27.3 270 top
LAN  RJLBC-060TC1  [RJLBC-060TC1]  5.87,19.68 270 top
LCD_CON  GBH-254-SMT-40  [ML40-MALE(GBH-254-SMT-40)]  36.07,75.56 0 top
LED1  LED/GREEN/0603  [LED-0603]  2.41,53.34 270 top
LINE_IN  PJ-W47S-05D2-LF_V2  [PJ-W47S-05D2-LF_5PIN_V2]  102.23,28.32 180 top
MENU  SIDE_WTCM-TR(3X4)  [SW_TAKT3X4]  76.71,1.91 180 bottom
MIC/TV  NA(HN1X10)  [HN1X10]  77.47,15.49 0 top
POWER  T1107A(6x3.8x2.5mm)  [SW-TAKT_6X3.5_SMD]  38.1,66.04 90 top
PWR  YDJ-1136  [PWR_JACK_UNI_MILLING]  7.62,61.19 0 top
PWR_LED  LED/RED/0603  [LED-0603]  2.41,58.17 270 top
Q1  Q25.000MHz/HC-49SM/SMD/20ppm/20pF  [HC49/SMD2_THIN]  34.42,22.86 270 top
Q2  Q24.000MHz/HC-49SM/SMD/20ppm/20pF  [HC49/SMD2_THIN]  64.52,62.87 180 top
R1  2k/1%  [R0603_5MIL_DWS]  40.89,38.1 90 top
R2  1R  [R0603_5MIL_DWS]  38.51,51.05 90 top
R3  2k/1%  [R0603_5MIL_DWS]  36.32,38.1 270 top
R4  NA  [R0603_5MIL_DWS]  40.89,34.8 90 top
R5  2k/1%  [R0603_5MIL_DWS]  40.89,31.5 270 top
R6  22R  [R0402_TI]  64.64,39.88 90 top
R7  22R  [R0402_TI]  65.66,39.88 90 top
R8  237R/1%  [R0603_5MIL_DWS]  52.83,28.19 180 top
R9  2k/1%  [R0603_5MIL_DWS]  36.32,31.5 90 top
R10  237R/1%  [R0603_5MIL_DWS]  65.41,34.29 270 bottom
R11  237/1%  [R0603_5MIL_DWS]  36.32,34.8 90 top
R12  2.2k  [R0603_5MIL_DWS]  39.24,12.7 0 top
R13  2.2k  [R0603_5MIL_DWS]  39.24,14.22 180 top
R14  2k/1%  [R0603_5MIL_DWS]  23.88,14.86 90 top
R15  237R/1%  [R0603_5MIL_DWS]  18.8,12.45 0 top
R16  NA  [R0603_5MIL_DWS]  36.83,13.34 270 top
R17  237R/1%  [R0603_5MIL_DWS]  18.8,13.97 0 top
R18  100k/1%  [R0603_5MIL_DWS]  91.95,5.84 270 bottom
R19  NA(1M)  [R0603_5MIL_DWS]  82.55,52.45 180 top
R20  10k  [R0603_5MIL_DWS]  82.55,50.93 180 top
R21  1k  [R0603_5MIL_DWS]  10.41,56.26 180 top
R22  NA  [R0603_5MIL_DWS]  63.12,55.5 90 top
R23  10k  [R0603_5MIL_DWS]  82.55,53.98 180 top
R24  0R(Board_Mounted)  [0603_0R]  64.64,55.5 270 top
R25  NA(1M)  [R0603_5MIL_DWS]  78.49,54.1 180 top
R26  2.2k  [R0603_5MIL_DWS]  81.92,62.79 0 top
R27  10k  [R0603_5MIL_DWS]  75.06,38.35 0 top
R28  200k/1%  [R0603_5MIL_DWS]  69.47,55.5 270 top
R29  2.2k  [R0603_5MIL_DWS]  81.92,61.26 0 top
R30  47k  [R0603_5MIL_DWS]  81.92,59.74 180 top
R31  10k  [R0603_5MIL_DWS]  75.06,40.26 0 top
R32  4.99k/1%  [R0603_5MIL_DWS]  14.61,29.84 90 top
R33  10k  [R0603_5MIL_DWS]  19.81,32.77 90 top
R34  13k/1%  [R0603_5MIL_DWS]  17.91,29.46 0 top
R35  10k  [R0603_5MIL_DWS]  13.08,29.84 270 top
R36  10k  [R0603_5MIL_DWS]  25.15,39.62 270 top
R37  13k/1%  [R0603_5MIL_DWS]  19.3,39.37 270 top
R38  NA  [R0603_5MIL_DWS]  52.58,68.2 270 top
R39  NA  [R0603_5MIL_DWS]  51.05,68.2 270 top
R40  1R  [R0603_5MIL_DWS]  69.47,58.8 90 top
R41  47k  [R0603_5MIL_DWS]  11.56,33.15 90 top
R42  2.2k  [R0603_5MIL_DWS]  87.38,77.09 0 top
R43  2.2k  [R0603_5MIL_DWS]  87.38,78.61 0 top
R44  47k  [R0603_5MIL_DWS]  87.38,80.14 0 top
R45  47k  [R0603_5MIL_DWS]  55.88,12.19 0 top
R46  10k  [R0603_5MIL_DWS]  77.85,18.54 180 top
R47  10k  [R0603_5MIL_DWS]  77.85,20.07 180 top
R48  1R  [R0603_5MIL_DWS]  14.73,67.69 180 top
R49  2.2k  [R0603_5MIL_DWS]  5.46,52.45 180 top
R50  47k  [R0603_5MIL_DWS]  14.73,63.63 180 top
R51  2.2k  [R0603_5MIL_DWS]  14.73,60.58 180 top
R52  2.2k  [R0603_5MIL_DWS]  14.73,62.1 180 top
R53  47k  [R0603_5MIL_DWS]  10.41,58.8 180 top
R54  1k  [R0603_5MIL_DWS]  36.45,69.22 180 top
R55  2.2k  [R0603_5MIL_DWS]  5.46,54.23 180 top
R56  10k  [R0603_5MIL_DWS]  34.54,11.56 90 bottom
R57  10k  [R0603_5MIL_DWS]  36.07,4.95 270 bottom
R58  NA  [R0402_TI]  50.8,40.64 90 bottom
R59  NA  [R0402_TI]  49.91,40.64 90 bottom
R60  0R(Board_Mounted)  [R0402_TI_0R]  53.47,40.64 90 bottom
R61  0R(Board_Mounted)  [R0402_TI_0R]  55.12,40.13 90 top
R62  0R(Board_Mounted)  [R0402_TI_0R]  52.58,40.64 90 bottom
R63  NA  [R0603_5MIL_DWS]  65.41,31.88 270 top
R64  NA  [R0603_5MIL_DWS]  52.83,29.72 0 top
R65  NA  [R0402_TI]  63.37,44.7 0 bottom
R66  47k  [R0603_5MIL_DWS]  61.21,15.75 180 bottom
R67  47k  [R0603_5MIL_DWS]  93.47,78.23 180 top
R68  0R(Board_Mounted)  [R0402_TI_0R]  51.69,40.64 90 bottom
R69  0R(Board_Mounted)  [R0402_TI_0R]  56.01,40.13 90 top
R70  0R(Board_Mounted)  [R0402_TI_0R]  56.9,40.13 90 top
R71  0R(Board_Mounted)  [R0402_TI_0R]  63.88,38.48 0 bottom
R72  10k  [R0603_5MIL_DWS]  36.07,11.56 90 bottom
R73  NA(10k)  [R0603_5MIL_DWS]  8.38,8 90 bottom
R79  6.81k/1%  [R0603_5MIL_DWS]  91.95,2.03 270 bottom
R80  8.25k/1%  [R0603_5MIL_DWS]  81.79,2.03 270 bottom
R81  10k/1%  [R0603_5MIL_DWS]  71.63,2.03 270 bottom
R82  11k/1%  [R0603_5MIL_DWS]  61.47,2.03 270 bottom
R83  13k/1%  [R0603_5MIL_DWS]  51.31,2.03 270 bottom
RM1  RA1206_(4X0603)_4B8_4.7k  [R_MATRIX_4]  18.92,18.29 180 top
RM2  RA1206_(4X0603)_4B8_4.7k  [R_MATRIX_4]  23.39,30.23 270 top
RM3  RA1206_(4X0603)_4B8_51R  [R_MATRIX_4]  26.8,14.86 90 top
RM4  RA1206_(4X0603)_4B8_100K  [R_MATRIX_4]  82.55,48.13 180 top
RM5  RA1206_(4X0603)_4B8_100K  [R_MATRIX_4]  78.49,51.05 180 top
RM6  RA1206_(4X0603)_4B8_51R  [R_MATRIX_4]  77.72,31.24 270 top
RM7  RA0805_(4X0402)_0R(Board_Mounted)  [R_MATRIX_4_0402_25_625_0R]  50.67,40.51 270 top
RM9  RA0805_(4X0402)_0R(Board_Mounted)  [R_MATRIX_4_0402_25_625_0R]  55.24,40.64 270 bottom
RM10  RA0805_(4X0402)_0R(Board_Mounted)  [R_MATRIX_4_0402_25_625_0R]  53.34,40.51 270 top
RM11  RA0805_(4X0402)_0R(Board_Mounted)  [R_MATRIX_4_0402_25_625_0R]  62.74,49.53 180 top
RM12  RA0805_(4X0402)_0R(Board_Mounted)  [R_MATRIX_4_0402_25_625_0R]  65.15,48.01 0 top
RM13  RA0805_(4X0402)_0R(Board_Mounted)  [R_MATRIX_4_0402_25_625_0R]  62.74,46.48 0 top
RM14  RA0805_(4X0402)_0R(Board_Mounted)  [R_MATRIX_4_0402_25_625_0R]  65.15,44.96 0 top
RM15  RA0805_(4X0402)_0R(Board_Mounted)  [R_MATRIX_4_0402_25_625_0R]  63.25,40.26 180 bottom
RM16  RA0805_(4X0402)_0R(Board_Mounted)  [R_MATRIX_4_0402_25_625_0R]  62.48,42.93 180 bottom
RM17  RA0805_(4X0402)_0R(Board_Mounted)  [R_MATRIX_4_0402_25_625_0R]  58.67,40.39 270 top
RM18  RA0805_(4X0402)_0R(Board_Mounted)  [R_MATRIX_4_0402_25_625_0R]  74.8,62.36 0 bottom
RM19  RA0805_(4X0402)_0R(Board_Mounted)  [R_MATRIX_4_0402_25_625_0R]  74.8,59.69 0 bottom
RM20  RA0805_(4X0402)_0R(Board_Mounted)  [R_MATRIX_4_0402_25_625_0R]  75.31,50.29 0 top
SD/MMC1  MICRO_SD+CP  [TFR-MEM-CON]  85.72,48.26 270 top
SD/MMC2  PSD006A-LT2-BA0  [SD_CARD]  85.98,41.91 270 bottom
T1  DTC114YKA  [SOT-23]  5.97,58.29 90 top
U1  A10S-TFBGA336  [TFBGA336]  52.97,49.61 90 top
U2  H5TQ2G83CFR-H9C  [FBGA78]  46.4,32.1 0 top
U3  H5TQ2G83CFR-H9C  [FBGA78]  59.3,32.1 0 top
U4  RTL8201CP  [LQFP48]  26.06,22.35 180 top
U5  AT24C16BN-SH  [SO-08MN]  43.99,16.81 180 top
U6  RCLAMP0524P  [SLP2510P8]  86.61,68.07 270 top
U7  RCLAMP0524P  [SLP2510P8]  86.61,65.07 270 top
U8  RCLAMP0524P  [SLP2510P8]  86.61,62.08 270 top
U9  SY6280  [SOT23-5]  17.4,32.38 0 top
U10  SY6280  [SOT23-5]  22.23,39.37 270 top
U11  AXP152  [QFN40_5X5]  21.97,60.58 0 top
U12  H27UBG8T2BTR  [TSOP48]  22.1,8.26 270 bottom
U15  FIDUCIAL1X2  [FIDUCIAL-1X2]  2.54,7.62 0 top
U16  FIDUCIAL1X2  [FIDUCIAL-1X2]  2.54,74.3 0 top
U17  FIDUCIAL1X2  [FIDUCIAL-1X2]  99.06,74.3 0 top
U$5  [LOGO-OPENHARDWARE_8X8]  49.4,66.17 0 bottom
U$6  [OLIMEX1_V]  53.09,7.49 0 bottom
U$8  [OLIMEX1_V]  57.33,57.53 0 top
U$9  [PB]  15.11,33.91 0 bottom
U$10  [ESD_SYMBOL]  24.26,30.1 0 bottom
U$11  [RECYCLE_BIN1/8]  12.19,29.97 0 bottom
U$12  [ROHS]  40.13,30.73 0 bottom
UART0  HN1X4  [HN1X4]  85.09,18.03 0 top
UART1  NA(HN1X4)  [HN1X4]  91.44,74.93 0 top
UBOOT/REC  HN1x3(UBOOT:Close;REC:Open)  [JP2]  68.58,18.03 0 top
UBOOT_EN  Open  [SJ_1_SMALLER]  48.77,1.52 270 bottom
UEXT  BH10S  [ML10_S]  75.44,75.56 0 top
USB_HOST  USB_A_VERTICAL  [USB_A_VERTICAL_PTH]  -5.71,51.05 270 top
USB_OTG  USB-OTG  [USB_MINI_9PIN]  4.45,35.69 0 top
VOL+  SIDE_WTCM-TR(3X4)  [SW_TAKT3X4]  97.03,1.91 180 bottom
VOL-  SIDE_WTCM-TR(3X4)  [SW_TAKT3X4]  86.87,1.91 180 bottom
VPS+  open  [SJ_1_THE_SMALLEST]  5.84,8.38 0 bottom
VPS-  open  [SJ_1_THE_SMALLEST]  5.84,9.91 0 bottom

## Tracks (layer width: path | path; a pad name or v marks a point on that pad's centre or on a via)
+5V  (via drill 0.4, 0.6, 0.6 pad 0.46)
  Top 0.203: 20.17,63.88 U11.30 | U11.29 20.57,63.63 20.32,63.88 20.24,63.88
  Top 0.254: C95.1 23.75,41.91 +5V/USB1-DRV.3
  Top 0.305: U9.5 16.45,34.04 C88.1
  Top 0.508: U10.5 23.62,40.32 C95.1 | v11.05,65.91 10.92,65.91
  Top 0.61: v14.1,34.04 C88.1 | C95.1 23.62,42.42 22.73,43.31 v19.56,43.31 | 20.24,63.88 20.17,63.88 18.87,63.88 v18.36,64.39 | LCD_CON.1 11.94,72.26 | R26.1 R29.1 | v62.23,5.21 60.2,7.24 GPIO-2.1 | v89.03,5.21 92.33,1.91 98.04,1.91 v100.08,3.94
  Top 0.762: R48.2 13.59,67.44 5V/LDO0.3 v11.05,65.91
  Top 0.813: FUSE1.1 84.81,58.47 80.21,58.47 78.74,59.94 v78.74,62.79 R26.1 | v11.94,75.06 LCD_CON.1 | v100.33,16.89 95.63,16.89 94.11,15.37 GPIO-3.1
  Top 1.016: PWR.+ 7.62,64.26 10.54,64.26 | 10.54,64.26 D2.C | FET1.2 11.05,62.55 11.05,64.26 | 10.54,64.26 11.05,64.26 | 11.05,64.26 v11.05,65.91 | v89.92,55.88 86.74,55.88 84.81,57.81 84.81,58.47
  Bottom 0.508: v19.56,43.31 19.56,37.08 16.51,34.04 v14.1,34.04 12.06,34.04 9.65,31.62 0.76,31.62
  Bottom 0.61: v89.92,55.88 91.44,54.36 92.33,54.36 94.74,51.94 94.74,41.91 100.08,36.58 100.08,16.89 | 100.08,16.89 v100.33,16.89 | 62.23,4.95 49.66,4.95 45.39,0.69 10.74,0.69 2.67,8.76 2.67,27.05 0.76,28.96 0.76,31.62 0.76,61.72 2.92,63.88 7.62,63.88 PWR.+ | 62.23,4.95 v62.23,5.21 | 62.23,4.95 88.77,4.95 v89.03,5.21 | v100.08,3.94 100.08,16.89
  Bottom 1.016: 11.05,67.18 17.53,67.18 18.36,66.34 v18.36,64.39 | v11.05,65.91 11.05,67.18 | 11.05,67.18 11.05,74.17 v11.94,75.06
+5V_OTG_PWR  (via drill 0.6, 0.6 pad 0.46)
  Top 0.61: USB_OTG.VBUS 8.71,37.29 L6.1 9.88,38.46 C87.1 v11.58,37.47 | v9.53,57.78 R53.2
  Top 1.016: FET1.3 9.53,61.59 R53.2
  Bottom 0.61: v11.58,37.47 10.92,37.47 4.57,43.81 4.57,53.59 8.76,57.78 v9.53,57.78
A0  (via drill 0.25 pad 0.46)
  Top 0.127: U2.K3 45.23,29.7 45.97,28.96 45.97,25.4 48.54,22.84 v49.47,22.84 | U3.K3 58.05,29.7 58.89,28.86 58.89,25.3 61.36,22.84 v62.37,22.84 63.09,22.84 68.71,28.45 68.71,44.58 66.42,46.86 63.88,46.86 63.51,47.23 RM13.1.2
  Bottom 0.127: v49.47,22.84 v62.37,22.84
A1  (via drill 0.25 pad 0.46)
  Top 0.127: U2.L7 v48.4,28.5 | U3.L7 61.3,28.5 61.9,28.5 62.1,28.3 62.1,27.9 62.3,27.7 63.25,27.7 63.63,28.08 v63.63,28.32
  Bottom 0.127: v48.4,28.5 48.75,28.15 49.69,28.15 50.18,27.66 50.65,27.66 63.21,27.66 63.63,28.08 v63.63,28.32 67.44,32.13 67.44,37.97 64.64,40.77 64.64,41.15 63.62,42.18 RM16.1.2
A2  (via drill 0.25 pad 0.46)
  Top 0.127: U2.L3 45.17,28.9 45.47,28.6 45.47,25.15 48.64,21.97 v49.47,21.97 | U3.L3 58.09,28.9 58.36,28.63 58.36,25.07 61.46,21.97 v62.37,21.97 62.99,21.97 69.22,28.19 69.22,44.83 66.29,47.76 RM12.3.2
  Bottom 0.127: v49.47,21.97 v62.37,21.97
A3  (via drill 0.25 pad 0.46)
  Top 0.127: U3.K2 57.3,29.3 58.07,29.3 58.63,28.74 58.63,25.19 61.41,22.4 v61.92,22.4 63.04,22.4 68.96,28.32 68.96,44.7 66.41,47.26 RM12.4.2 | U2.K2 44.4,29.3 45.25,29.3 45.72,28.83 45.72,25.27 48.59,22.4 v49.01,22.4
  Bottom 0.127: v49.01,22.4 v61.92,22.4
A4  (via drill 0.25 pad 0.46)
  Top 0.127: U3.L8 61.9,28.9 62.3,28.5 62.66,28.5 62.74,28.57 63.25,28.57 v63.63,28.96 | U2.L8 v49.12,28.57
  Bottom 0.127: v49.12,28.57 63.25,28.57 v63.63,28.96 63.88,28.96 67.18,32.26 67.18,37.85 64.02,41.01 RM15.4.2
A5  (via drill 0.25 pad 0.46)
  Top 0.127: U3.L2 57.3,28.5 57.97,28.5 58.09,28.37 58.09,24.96 61.51,21.54 v61.92,21.54 62.94,21.54 69.47,28.07 69.47,44.96 66.17,48.26 RM12.2.2 | U2.L2 44.4,28.5 45.06,28.5 45.21,28.35 45.21,25.02 48.69,21.54 v49.01,21.54
  Bottom 0.127: v49.01,21.54 v61.92,21.54
A6  (via drill 0.25 pad 0.46)
  Top 0.127: v49.2,27.7 U2.M8 | U3.M8 61.7,27.9 62.1,27.5 62.1,27.12 62.45,26.77 63.21,26.77 63.57,27.13 v63.57,27.41
  Bottom 0.127: v49.2,27.7 50.1,26.8 63.24,26.8 63.57,27.13 v63.57,27.41 63.57,27.63 64.14,28.19 64.14,28.45 67.69,32 67.69,38.1 64.9,40.89 64.9,41.27 63.5,42.68 RM16.2.2
A7  (via drill 0.25 pad 0.46)
  Top 0.127: U3.M2 56.5,27.7 56.5,25.03 61.71,19.81 v61.92,19.81 62.74,19.81 70.48,27.56 70.48,45.47 66.29,49.66 63.63,49.66 63.5,49.78 RM11.3.1 | U2.M2 43.6,27.7 43.6,26.89 44.2,26.29 44.2,24.51 48.89,19.81 v49.9,19.81
  Bottom 0.127: v49.9,19.81 v61.92,19.81
A8  (via drill 0.25 pad 0.46)
  Top 0.127: U2.N8 49.01,27.09 v49.01,26.72 | U3.N8 61.7,27.15 62.33,26.52 63.34,26.52 64.03,27.2 64.03,27.7 v64.64,28.32
  Bottom 0.127: v49.01,26.72 49.73,26.72 49.9,26.54 63.37,26.54 64.03,27.2 64.03,27.7 v64.64,28.32 64.64,28.57 67.94,31.88 67.94,38.23 65.15,41.02 65.15,41.4 63.38,43.18 RM16.3.2
A9  (via drill 0.25 pad 0.46)
  Top 0.127: U3.M3 57.3,27.7 57.3,24.99 61.61,20.68 v61.92,20.68 62.84,20.68 69.98,27.81 69.98,45.21 66.04,49.15 63.88,49.15 63.51,48.78 RM11.1.1 | U2.M3 44.4,27.7 44.4,26.85 44.7,26.54 44.7,24.77 48.79,20.68 v49.01,20.68
  Bottom 0.127: v49.01,20.68 v61.92,20.68
A10  (via drill 0.25 pad 0.46)
  Top 0.127: U3.H7 61.1,31.3 61.5,30.9 62.9,30.9 v63.12,31.11 | U2.H7 v48.3,31
  Bottom 0.127: v48.3,31 48.54,30.76 49.68,30.76 49.93,31.01 54.8,31.01 54.95,30.86 62.87,30.86 v63.12,31.11 63.63,31.62 65.41,31.62 66.42,32.64 66.42,37.47 64.38,39.51 RM15.1.2
A11  (via drill 0.25 pad 0.46)
  Top 0.127: v49.47,26.29 48.73,26.29 48.4,26.62 48.4,27.7 U2.M7 | U3.M7 61.3,27.7 61.3,27.12 62.16,26.27 63.47,26.27 64.52,27.32 v64.52,27.56
  Bottom 0.127: v49.47,26.29 63.49,26.29 64.52,27.32 v64.52,27.56 65.15,28.19 65.15,28.7 68.2,31.75 68.2,38.35 65.41,41.15 65.41,41.53 63.26,43.68 RM16.4.2
A12  (via drill 0.25 pad 0.46)
  Top 0.127: U2.K7 v48.4,29.3 | v63.85,29.57 63.7,29.41 62.78,29.41 62.66,29.3 61.3,29.3 U3.K7
  Bottom 0.127: v48.4,29.3 49.18,29.3 49.6,28.88 62.23,28.88 62.77,29.41 63.7,29.41 v63.85,29.57 64.12,29.57 66.93,32.38 66.93,37.72 64.14,40.51 RM15.3.2
A13  (via drill 0.25 pad 0.46)
  Top 0.127: U3.N3 57.7,24.97 61.56,21.11 v62.37,21.11 62.89,21.11 69.72,27.94 69.72,45.09 66.05,48.76 RM12.1.2 | U2.N3 44.8,26.83 44.96,26.67 44.96,24.89 48.74,21.11 v49.47,21.11
  Bottom 0.127: v49.47,21.11 v62.37,21.11
A14  (via drill 0.25 pad 0.46)
  Top 0.127: U2.N7 48,26.59 48.73,25.86 v49.01,25.86 | U3.N7 60.9,26.82 v61.87,25.86 63.45,25.86 66.93,29.34 66.93,43.69 66.41,44.21 RM14.4.2
  Bottom 0.127: v49.01,25.86 v61.87,25.86
AVDD33
  Top 0.203: U4.36 28.81,17.06 29.34,16.54 29.34,16.13 C47.2
  Top 0.61: C47.2 C48.2 32,15.75 L1.1
BA0  (via drill 0.25 pad 0.46)
  Top 0.127: U3.J2 57.3,30.1 58.03,30.1 59.16,28.97 59.16,25.41 61.31,23.27 v61.92,23.27 63.15,23.27 68.45,28.57 68.45,44.45 66.29,46.61 63.63,46.61 63.5,46.73 RM13.2.2 | U2.J2 44.4,30.1 45.21,30.1 46.23,29.08 46.23,25.53 48.49,23.27 v49.01,23.27
  Bottom 0.127: v49.01,23.27 v61.92,23.27
BA1  (via drill 0.25 pad 0.46)
  Top 0.127: U3.K8 62.1,30.1 62.66,30.1 62.84,30.28 63.55,30.28 v64.39,31.11 | U2.K8 v49.2,30.1
  Bottom 0.127: v49.2,30.1 49.53,30.1 50.16,30.73 54.61,30.73 54.74,30.61 63.88,30.61 v64.39,31.11 65.28,31.11 66.67,32.51 66.67,37.59 64.26,40.01 RM15.2.2
BA2  (via drill 0.25 pad 0.46)
  Top 0.127: U2.J3 45.19,30.5 46.48,29.21 46.48,25.65 48.44,23.7 v49.47,23.7 | U3.J3 58.01,30.5 59.43,29.08 59.43,25.53 61.26,23.7 v62.37,23.7 63.2,23.7 68.2,28.7 68.2,44.32 66.17,46.35 63.63,46.35 63.5,46.23 RM13.3.2
  Bottom 0.127: v49.47,23.7 v62.37,23.7
CASN  (via drill 0.25 pad 0.46)
  Top 0.127: U3.G3 57.7,31.95 60.23,29.43 60.23,25.87 61.27,24.83 61.75,24.83 v61.92,25 63.35,25 67.44,29.08 67.44,43.94 66.17,45.21 RM14.2.2 | U2.G3 44.8,32.05 47.24,29.61 47.24,26.04 48.45,24.83 48.85,24.83 v49.01,25
  Bottom 0.127: v49.01,25 v61.92,25
CKE0  (via drill 0.25 pad 0.46)
  Top 0.127: v63.06,32.04 63,32.1 U3.G9 | U2.G9 49.65,32.05 v50.29,32.05
  Bottom 0.127: v50.29,32.05 50.47,32.23 59.66,32.23 60.09,31.8 60.62,31.8 60.95,32.13 62.97,32.13 v63.06,32.04 63.22,31.88 64.52,31.88 64.64,32 64.64,32.51 64.77,32.64 64.9,32.64 65.02,32.51 65.02,32 65.15,31.88 65.28,31.88 65.41,32 65.41,32.51 65.53,32.64 66.04,32.64 66.17,32.77 66.17,35.81 66.04,35.94 63.5,35.94 63.37,36.07 63.37,36.2 63.5,36.32 66.04,36.32 66.17,36.45 66.17,37.21 66.04,37.34 62.87,37.34 62.74,37.47 62.74,37.59 62.87,37.72 65.28,37.72 65.41,37.85 65.41,38.1 65.02,38.48 R71.1
CKE1  (via drill 0.25 pad 0.46)
  Top 0.127: U2.F9 50.76,32.9 v51.05,33.2 | v63.1,33.5 U3.F9 | v66.17,41.15 66.42,40.89 66.42,36.96 66.29,36.83 v65.66,36.83
  Bottom 0.127: 62.52,33.5 60.04,33.5 59.56,33.02 51.23,33.02 v51.05,33.2 | 62.52,33.5 v63.1,33.5 | v66.17,41.15 63.63,43.69 63.63,44.45 R65.1 | 62.52,33.5 62.52,36.24 63.12,36.83 v65.66,36.83
CLK  (via drill 0.25 pad 0.46)
  Top 0.127: U3.F7 60.87,32.87 v60.34,32.87 | U2.F7 v47.5,32.89 | v63.37,32.96 63.63,33.21 63.63,33.78 63.88,34.04 65.91,34.04 66.04,34.16 66.04,34.42 65.91,34.54 63.75,34.54 63.5,34.8 63.5,35.31 63.75,35.56 65.91,35.56 66.04,35.69 66.04,35.94 65.91,36.07 63.25,36.07 62.99,36.32 62.99,36.83 63.25,37.08 64.77,37.08 65.02,37.34 65.02,38.06 64.96,38.12 64.96,38.35 | 64.96,38.35 64.96,39.05 R6.1 | 64.96,38.35 C130.2
  Bottom 0.127: 60.34,32.77 63.18,32.77 v63.37,32.96 | 60.34,32.77 v60.34,32.87 | v47.5,32.89 47.62,32.77 60.34,32.77
CLKN  (via drill 0.25 pad 0.46)
  Top 0.127: U3.G7 60.77,32.23 v60.34,32.23 | U2.G7 47.84,32.26 v47.5,32.26 | 65.34,38.35 65.34,38.12 65.28,38.06 65.28,37.21 64.9,36.83 63.37,36.83 63.25,36.7 63.25,36.45 63.37,36.32 66.04,36.32 66.29,36.07 66.29,35.56 66.04,35.31 63.88,35.31 63.75,35.18 63.75,34.92 63.88,34.8 66.04,34.8 66.29,34.54 66.29,34.04 66.04,33.78 64.01,33.78 63.88,33.66 63.88,32.96 v64.01,32.83 | 65.34,38.35 65.34,39.05 R7.1 | 65.34,38.35 C130.1
  Bottom 0.127: v64.01,32.83 63.88,32.83 63.54,32.49 60.6,32.49 60.52,32.41 60.34,32.41 | 60.34,32.41 60.16,32.41 60.09,32.49 47.73,32.49 v47.5,32.26 | 60.34,32.41 v60.34,32.23
CS0
  Top 0.107: 58.17,45.72 59.3,45.72
  Top 0.127: 58.17,45.72 U1.V5 | 59.3,45.72 59.43,45.72 59.69,45.97 61.59,45.97 61.84,45.73 RM13.4.1
CS1  (via drill 0.2)
  Top 0.127: v54.27,45.06 U1.N4
  Bottom 0.107: 52.65,43.94 52.66,43.94 52.67,43.94 53.47,44.74 53.95,44.74
  Bottom 0.127: 53.95,44.74 v54.27,45.06 | 52.66,43.94 52.58,43.94 50.8,42.16 R58.2
D0
  Top 0.127: U2.B3 45.21,36.51 45.21,36.96 45.34,37.08 45.97,37.08 46.1,37.22 46.1,39.12 46.23,39.24 46.35,39.24 46.48,39.12 46.48,37.97 46.61,37.85 46.74,37.85 46.86,37.97 46.86,39.12 46.99,39.24 47.12,39.24 47.24,39.12 47.24,38.73 47.37,38.61 47.5,38.61 47.62,38.73 47.62,39.12 47.75,39.24 49.91,39.24 50.42,39.76 RM7.3.2
D1  (via drill 0.25 pad 0.46)
  Top 0.127: U2.C7 v48.4,35.7
  Bottom 0.127: v48.4,35.7 48.73,35.37 50.42,35.37 50.55,35.5 50.55,37.72 50.67,37.85 52.83,37.85 54.49,39.51 RM9.1.2
D2
  Top 0.127: U2.C2 44.31,35.3 44.4,35.39 44.4,37.13 44.13,37.4 44.13,38.1 44.26,38.23 44.58,38.23 44.7,38.1 44.7,37.47 44.83,37.34 44.96,37.34 45.09,37.47 45.09,38.1 45.21,38.23 45.34,38.23 45.47,38.1 45.47,37.47 45.59,37.34 45.72,37.34 45.85,37.47 45.85,39.37 45.97,39.5 48.26,39.5 48.39,39.62 48.39,39.88 48.51,40.01 48.64,40.01 48.77,39.88 48.77,39.62 48.9,39.5 49.02,39.5 49.15,39.62 49.15,40.31 49.28,40.44 49.4,40.44 49.53,40.31 49.53,40.12 49.65,40 RM7.4.2
D3  (via drill 0.25 pad 0.46)
  Top 0.127: U2.C8 49.2,35.7 50.39,35.7 50.67,35.42 50.67,35.18 50.8,35.05 50.93,35.05 51.05,35.18 v51.05,35.94
  Bottom 0.127: v51.05,35.94 51.17,35.94 51.56,36.34 51.56,37.47 51.69,37.59 51.82,37.59 51.94,37.47 51.94,36.96 52.07,36.83 52.2,36.83 54.99,39.63 RM9.2.2
D4
  Top 0.127: U2.E3 46.12,32.38 46.81,32.38 46.99,32.56 46.99,34.67 47.5,35.18 47.5,37.08 48.64,38.23 51.94,38.23 52.07,38.35 52.07,39.58 51.9,39.75 51.42,39.75 RM7.1.2
D5  (via drill 0.25 pad 0.46)
  Top 0.127: U2.E8 v49.12,34.02
  Bottom 0.127: v49.12,34.02 49.26,34.16 50.29,34.16 51.05,34.92 52.06,34.92 52.18,35.05 52.18,35.18 52.06,35.31 51.8,35.31 51.69,35.42 51.69,35.56 55.99,39.87 RM9.4.2
D6
  Top 0.127: U2.D2 44.4,34.1 46.22,34.1 46.35,33.97 46.35,32.77 46.48,32.64 46.61,32.64 46.74,32.77 46.74,34.8 47.24,35.31 47.24,37.21 48.51,38.48 51.69,38.48 51.82,38.61 51.82,39.24 51.56,39.5 51.05,39.5 50.92,39.63 RM7.2.2
D7  (via drill 0.25 pad 0.46)
  Top 0.127: U2.E7 v48.4,34.1
  Bottom 0.127: v48.4,34.1 48.77,34.47 50.22,34.47 55.49,39.75 RM9.3.2
D8  (via drill 0.2, 0.25 pad 0.46)
  Top 0.127: U3.B3 v57.3,35.7 | v58.42,39.37 RM17.3.2
  Bottom 0.127: v57.3,35.7 57.02,35.98 57.02,37.05 56.73,37.34 56.39,37.34 56.26,37.47 56.26,37.59 56.39,37.72 57.91,37.72 58.04,37.85 58.04,37.97 57.91,38.1 56.39,38.1 56.26,38.23 56.26,38.35 56.39,38.48 57.91,38.48 58.04,38.61 58.04,38.73 57.91,38.86 57.28,38.86 57.15,38.99 57.15,39.12 57.28,39.24 58.29,39.24 v58.42,39.37
D9
  Top 0.127: U3.C7 60.77,35.43 60.58,35.43 60.45,35.56 60.45,37.34 60.58,37.47 61.28,37.47 61.4,37.59 61.4,37.72 61.28,37.85 60.2,37.85 60.07,37.72 60.07,36.7 59.94,36.58 59.82,36.58 59.69,36.7 59.69,37.72 59.56,37.85 59.44,37.85 59.31,37.72 59.31,37.47 59.18,37.34 59.05,37.34 58.93,37.47 58.93,37.97 58.8,38.1 55.63,38.1 54.61,39.12 54.61,39.84 54.46,39.99 RM10.1.2
D10  (via drill 0.2, 0.25 pad 0.46)
  Top 0.127: U3.C2 v57.3,34.9 | RM17.1.2 59.44,39.86 59.44,39.62 60.07,38.99 v60.2,38.99
  Bottom 0.127: v57.3,34.9 57.78,35.38 57.78,35.81 57.91,35.94 58.17,35.94 58.29,36.07 58.29,36.2 58.17,36.32 57.4,36.32 57.28,36.45 57.28,36.58 57.4,36.7 58.17,36.7 58.29,36.83 58.29,36.96 58.17,37.08 57.4,37.08 57.28,37.21 57.28,37.34 57.4,37.47 58.17,37.47 58.29,37.59 58.29,38.84 58.45,38.99 v60.2,38.99
D11  (via drill 0.25 pad 0.46)
  Top 0.127: v61.3,34.9 U3.C8 | v59.31,34.56 59.31,35.91 57.88,37.34 55.24,37.34 53.47,39.12 53.21,39.12 52.59,39.74 RM10.4.2
  Bottom 0.127: v59.31,34.56 59.65,34.9 v61.3,34.9
D12  (via drill 0.2, 0.25 pad 0.46)
  Top 0.127: U3.E3 v58.1,34.1 | v57.53,40.13 57.53,39.96 57.66,39.83 57.92,39.83 RM17.4.2
  Bottom 0.127: v58.1,34.1 59.18,35.18 60.33,35.18 60.58,35.43 60.58,39.28 59.73,40.13 v57.53,40.13
D13
  Top 0.127: U3.E8 61.7,33.65 61.35,33.3 59.97,33.3 58.99,32.32 58.74,32.32 58.36,32.7 58.36,32.96 59.82,34.42 59.82,35.81 58.04,37.59 55.37,37.59 53.59,39.37 53.34,39.37 53.09,39.62 RM10.3.2
D14  (via drill 0.2, 0.25 pad 0.46)
  Top 0.127: U3.D2 v56.5,34.9 | RM17.2.2 v58.93,39.37
  Bottom 0.127: v56.5,34.9 56.01,35.39 56.01,39.36 56.13,39.48 56.26,39.48 56.39,39.36 56.39,38.86 56.52,38.73 56.64,38.73 56.77,38.86 56.77,40.13 56.9,40.26 57.02,40.26 57.15,40.13 57.15,39.89 57.29,39.75 58.55,39.75 v58.93,39.37
D15
  Top 0.127: U3.E7 60.78,33.58 59.87,33.58 59.14,32.85 59.02,32.85 58.89,32.98 58.89,33.11 59.82,34.04 60.43,34.04 60.55,34.16 60.55,34.29 60.43,34.42 60.2,34.42 60.07,34.54 60.07,34.67 60.2,34.8 60.45,34.8 60.58,34.92 60.58,35.05 60.45,35.18 60.2,35.18 60.07,35.31 60.07,35.94 58.17,37.85 55.5,37.85 53.59,39.76 RM10.2.2
DDR3_A0
  Top 0.107: 58.17,47.02 59.31,47.02
  Top 0.127: U1.V7 58.17,47.02 | 59.31,47.02 61.62,47.02 61.84,47.23 RM13.1.1
DDR3_A1  (via drill 0.2)
  Top 0.127: v55.57,45.06 U1.R4
  Bottom 0.107: 55.9,44.74 55.9,44.23
  Bottom 0.127: v55.57,45.06 55.9,44.74 | 55.9,44.23 56.19,43.94 59.82,43.94 61.58,42.18 RM16.1.1
DDR3_A2  (via drill 0.2)
  Top 0.127: U1.U8 v57.52,47.66 | v61.21,47.75 61.34,47.88 64.26,47.88 64.39,47.76 RM12.3.1
  Bottom 0.127: v57.52,47.66 57.61,47.75 v61.21,47.75
DDR3_A3  (via drill 0.2)
  Top 0.127: U1.U7 v57.52,47.02 | RM12.4.1 64.38,47.26 64.01,47.62 61.72,47.62 v61.47,47.37
  Bottom 0.127: v57.52,47.02 57.88,47.37 v61.47,47.37
DDR3_A4  (via drill 0.2)
  Top 0.127: U1.P3 v55.57,44.41
  Bottom 0.127: v55.57,44.41 55.57,44.19 56.08,43.69 59.69,43.69 62.37,41.01 RM15.4.1
DDR3_A5
  Top 0.107: 58.17,47.66 59.3,47.66
  Top 0.127: U1.V8 58.17,47.66 | RM12.2.1 64.39,48.26 64.26,48.13 61.09,48.13 60.62,47.66 59.3,47.66
DDR3_A6  (via drill 0.2)
  Top 0.127: U1.R3 v56.22,44.41
  Bottom 0.127: v56.22,44.41 56.44,44.2 59.94,44.2 61.46,42.68 RM16.2.1
DDR3_A7
  Top 0.107: 58.17,48.97 59.38,48.97
  Top 0.127: U1.V10 58.17,48.97 | RM11.3.2 61.97,49.78 61.47,49.28 59.69,49.28 59.38,48.97
DDR3_A8  (via drill 0.2)
  Top 0.127: U1.T3 v56.22,45.06
  Bottom 0.127: v56.22,45.06 56.84,44.45 60.07,44.45 61.34,43.18 RM16.3.1
DDR3_A9
  Top 0.107: 58.17,48.31 59.3,48.31
  Top 0.127: U1.V9 58.17,48.31 | RM11.1.2 61.99,48.78 61.85,48.64 60.45,48.64 60.13,48.31 59.3,48.31
DDR3_A10  (via drill 0.2)
  Top 0.127: v54.27,44.41 U1.M3
  Bottom 0.127: v54.27,44.41 54.27,44.38 55.73,42.93 59.31,42.93 61.98,40.26 61.98,39.88 62.34,39.51 RM15.1.1
DDR3_A11  (via drill 0.2)
  Top 0.127: U1.T4 v56.87,45.06
  Bottom 0.127: v56.87,45.06 57.23,44.7 60.2,44.7 61.23,43.68 RM16.4.1
DDR3_A12  (via drill 0.2)
  Top 0.127: U1.P4 v54.92,45.06
  Bottom 0.107: 55.25,44.74 55.25,44.2
  Bottom 0.127: v54.92,45.06 55.25,44.74 | 55.25,44.2 55.25,44.15 55.97,43.43 59.56,43.43 62.49,40.51 RM15.3.1
DDR3_A13  (via drill 0.2)
  Top 0.127: U1.U9 v57.52,48.31 | RM12.1.1 64.38,48.76 64.01,48.39 60.83,48.39 v60.71,48.26
  Bottom 0.127: v57.52,48.31 57.58,48.26 v60.71,48.26
DDR3_A14  (via drill 0.2)